# EAGLE schematic LEDSyncDRVG2 (EAGLE 9.6.2)

## Sheet 1 of 5
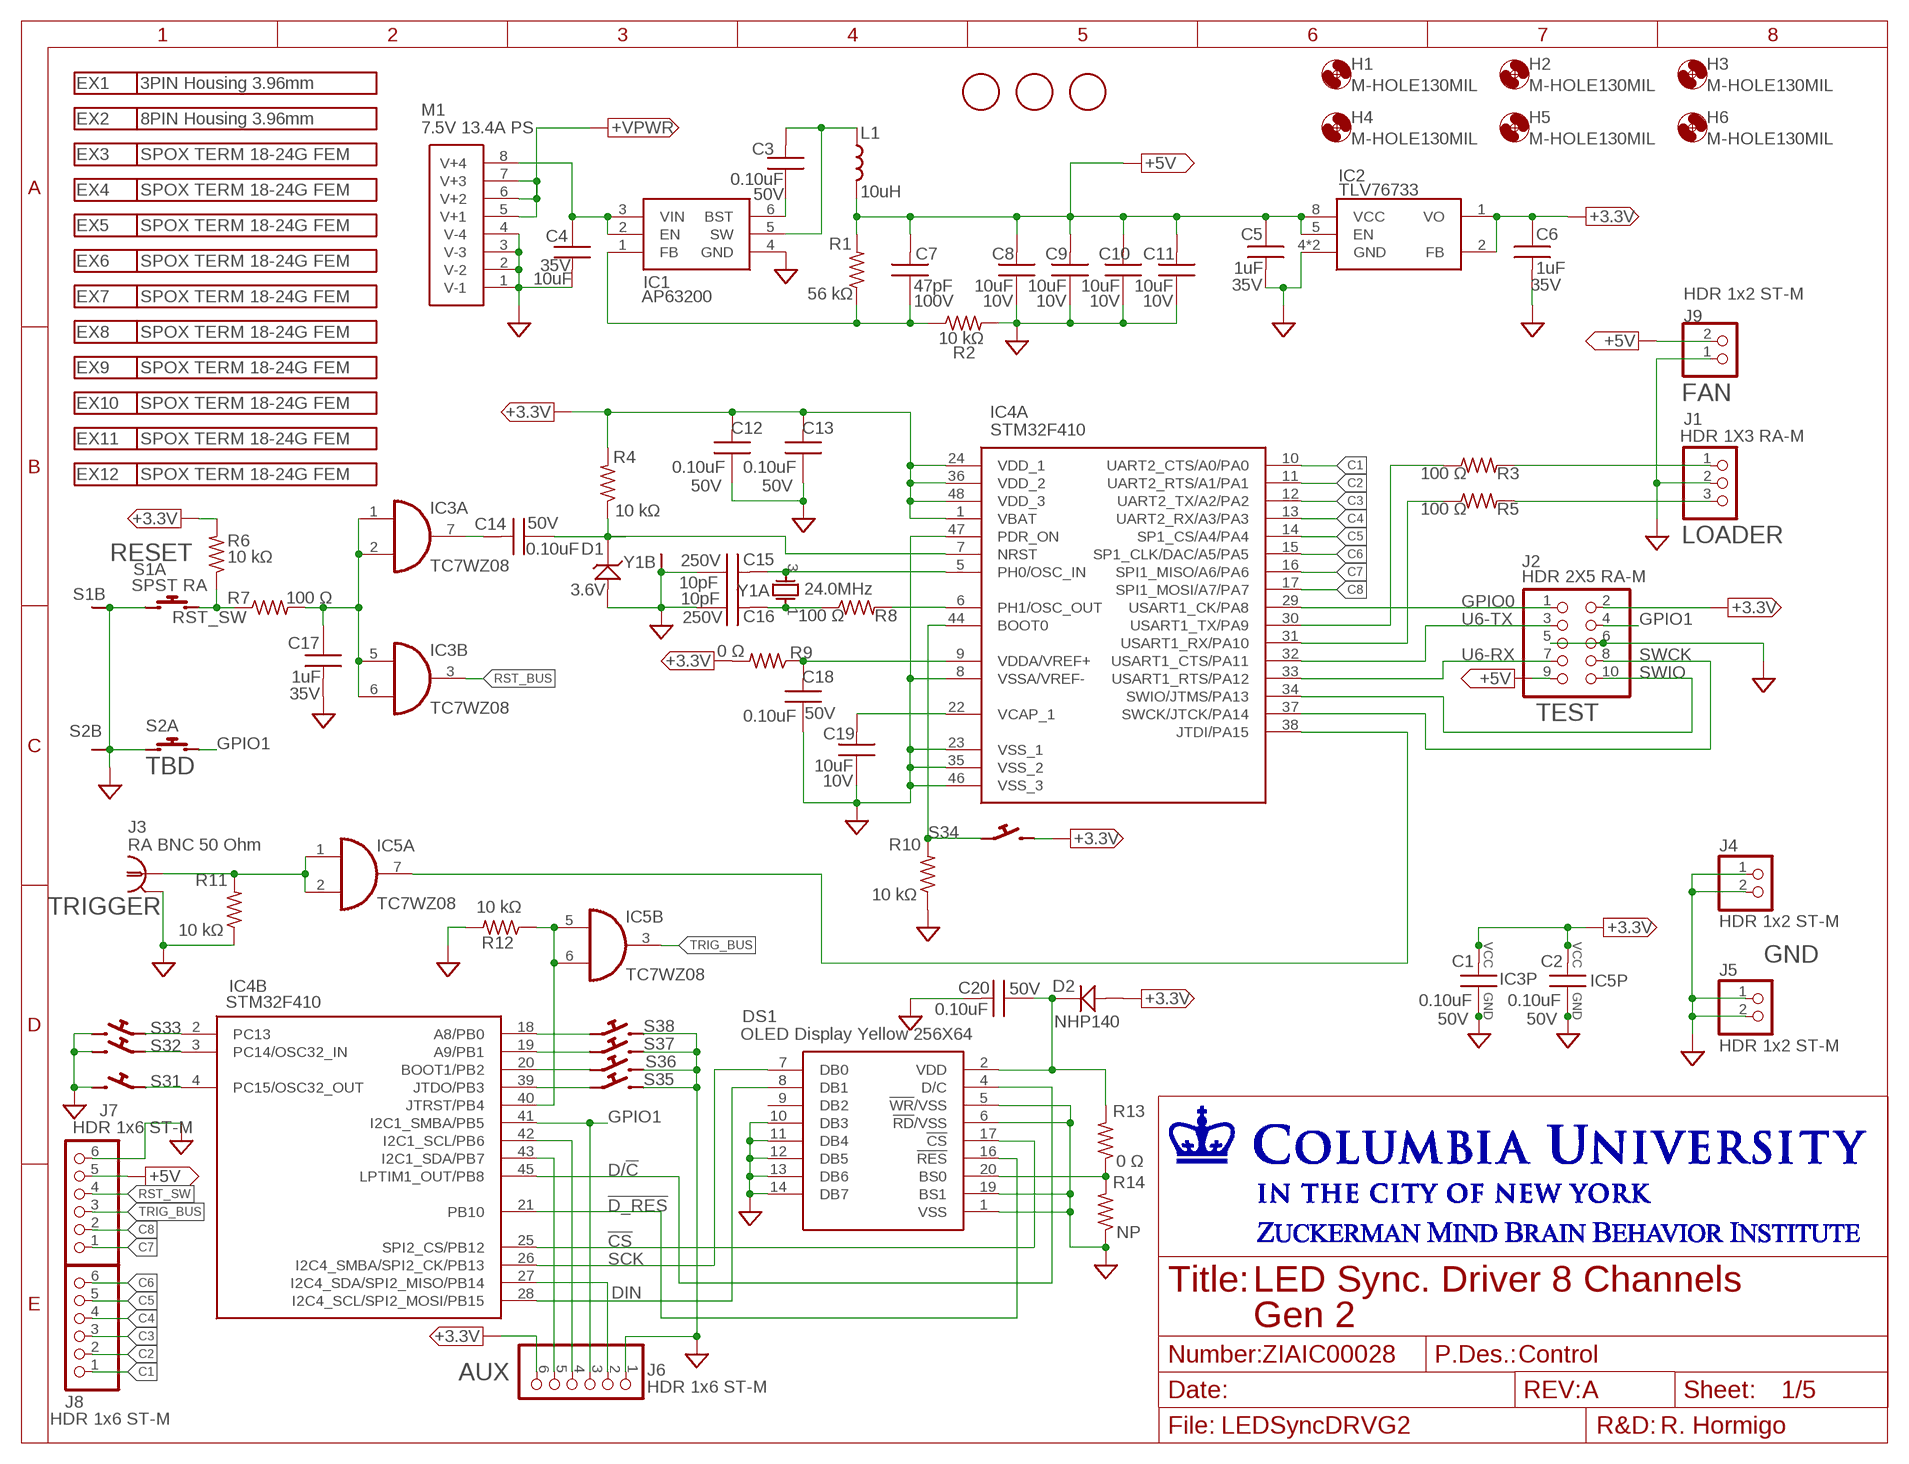
[diagram p0: schematic, sheet 1]
EX1 (EXTCONNWIRE_HOUSING_3P_3.96MM): DESCRIPTION: 3.96mm Pitch SPOX Crimp Housing, Female 3 Pin; DSHEET: https://www.mouser.com/datasheet/2/276/0009501031_CRIMP_HOUSINGS-156478.pdf; MNF: MOLEX; MPN: 09-50-1031; VALUE: 3PIN Housing 3.96mm; VENDOR: Mouser
EX2 (EXTCONNWIRE_HOUSING_8P_3.96MM): DESCRIPTION: 3.96mm Pitch SPOX Crimp Housing, Female 8 Pin; DSHEET: https://www.mouser.com/datasheet/2/276/0009501081_CRIMP_HOUSINGS-156365.pdf; MNF: MOLEX; MPN: 09-50-1081; VALUE: 8PIN Housing 3.96mm; VENDOR: Mouser
EX3 (EXTCONNSPOX_MOLEX5194_CRIMP_TERMINAL_F): CURRENT: 7A@AWG18; DESCRIPTION: SPOX Crimp Female Terminal 5194, 18-24 AWG, Brass, 7A@AWG18; DSHEET: https://www.mouser.com/datasheet/2/276/0008701031_CRIMP_TERMINALS-156261.pdf; MNF: MOLEX; MPN: 08-70-1031; VALUE: SPOX TERM 18-24G FEM; VENDOR: Mouser
EX4 (EXTCONNSPOX_MOLEX5194_CRIMP_TERMINAL_F): CURRENT: 7A@AWG18; DESCRIPTION: SPOX Crimp Female Terminal 5194, 18-24 AWG, Brass, 7A@AWG18; DSHEET: https://www.mouser.com/datasheet/2/276/0008701031_CRIMP_TERMINALS-156261.pdf; MNF: MOLEX; MPN: 08-70-1031; VALUE: SPOX TERM 18-24G FEM; VENDOR: Mouser
EX5 (EXTCONNSPOX_MOLEX5194_CRIMP_TERMINAL_F): CURRENT: 7A@AWG18; DESCRIPTION: SPOX Crimp Female Terminal 5194, 18-24 AWG, Brass, 7A@AWG18; DSHEET: https://www.mouser.com/datasheet/2/276/0008701031_CRIMP_TERMINALS-156261.pdf; MNF: MOLEX; MPN: 08-70-1031; VALUE: SPOX TERM 18-24G FEM; VENDOR: Mouser
EX6 (EXTCONNSPOX_MOLEX5194_CRIMP_TERMINAL_F): CURRENT: 7A@AWG18; DESCRIPTION: SPOX Crimp Female Terminal 5194, 18-24 AWG, Brass, 7A@AWG18; DSHEET: https://www.mouser.com/datasheet/2/276/0008701031_CRIMP_TERMINALS-156261.pdf; MNF: MOLEX; MPN: 08-70-1031; VALUE: SPOX TERM 18-24G FEM; VENDOR: Mouser
EX7 (EXTCONNSPOX_MOLEX5194_CRIMP_TERMINAL_F): CURRENT: 7A@AWG18; DESCRIPTION: SPOX Crimp Female Terminal 5194, 18-24 AWG, Brass, 7A@AWG18; DSHEET: https://www.mouser.com/datasheet/2/276/0008701031_CRIMP_TERMINALS-156261.pdf; MNF: MOLEX; MPN: 08-70-1031; VALUE: SPOX TERM 18-24G FEM; VENDOR: Mouser
EX8 (EXTCONNSPOX_MOLEX5194_CRIMP_TERMINAL_F): CURRENT: 7A@AWG18; DESCRIPTION: SPOX Crimp Female Terminal 5194, 18-24 AWG, Brass, 7A@AWG18; DSHEET: https://www.mouser.com/datasheet/2/276/0008701031_CRIMP_TERMINALS-156261.pdf; MNF: MOLEX; MPN: 08-70-1031; VALUE: SPOX TERM 18-24G FEM; VENDOR: Mouser
EX9 (EXTCONNSPOX_MOLEX5194_CRIMP_TERMINAL_F): CURRENT: 7A@AWG18; DESCRIPTION: SPOX Crimp Female Terminal 5194, 18-24 AWG, Brass, 7A@AWG18; DSHEET: https://www.mouser.com/datasheet/2/276/0008701031_CRIMP_TERMINALS-156261.pdf; MNF: MOLEX; MPN: 08-70-1031; VALUE: SPOX TERM 18-24G FEM; VENDOR: Mouser
EX10 (EXTCONNSPOX_MOLEX5194_CRIMP_TERMINAL_F): CURRENT: 7A@AWG18; DESCRIPTION: SPOX Crimp Female Terminal 5194, 18-24 AWG, Brass, 7A@AWG18; DSHEET: https://www.mouser.com/datasheet/2/276/0008701031_CRIMP_TERMINALS-156261.pdf; MNF: MOLEX; MPN: 08-70-1031; VALUE: SPOX TERM 18-24G FEM; VENDOR: Mouser
EX11 (EXTCONNSPOX_MOLEX5194_CRIMP_TERMINAL_F): CURRENT: 7A@AWG18; DESCRIPTION: SPOX Crimp Female Terminal 5194, 18-24 AWG, Brass, 7A@AWG18; DSHEET: https://www.mouser.com/datasheet/2/276/0008701031_CRIMP_TERMINALS-156261.pdf; MNF: MOLEX; MPN: 08-70-1031; VALUE: SPOX TERM 18-24G FEM; VENDOR: Mouser
EX12 (EXTCONNSPOX_MOLEX5194_CRIMP_TERMINAL_F): CURRENT: 7A@AWG18; DESCRIPTION: SPOX Crimp Female Terminal 5194, 18-24 AWG, Brass, 7A@AWG18; DSHEET: https://www.mouser.com/datasheet/2/276/0008701031_CRIMP_TERMINALS-156261.pdf; MNF: MOLEX; MPN: 08-70-1031; VALUE: SPOX TERM 18-24G FEM; VENDOR: Mouser
FRAME1 (LETTER_L): ENG_NAME: R. Hormigo; NUMBER: ZIAIC00028; PDESC: Control; REV: A; TITLE_L1: LED Sync. Driver 8 Channels; TITLE_L2: Gen 2

### Parts
C1  0.10uF  MLCC_0603_100N  [MLCC_0603]
C2  0.10uF  MLCC_0603_100N  [MLCC_0603]
C3  0.10uF  MLCC_0603_100N  [MLCC_0603]
C4  10uF  MLCC1206_  [MLCC_1206]
C5  1uF  MLCC_0603_1UF  [MLCC_0603]
C6  1uF  MLCC_0603_1UF  [MLCC_0603]
C7  47pF  MLCC_0603_47P  [MLCC_0603]
C8  10uF  MLCC_0603_10UF-10V  [MLCC_0603]
C9  10uF  MLCC_0603_10UF-10V  [MLCC_0603]
C10  10uF  MLCC_0603_10UF-10V  [MLCC_0603]
C11  10uF  MLCC_0603_10UF-10V  [MLCC_0603]
C12  0.10uF  MLCC_0603_100N  [MLCC_0603]
C13  0.10uF  MLCC_0603_100N  [MLCC_0603]
C14  0.10uF  MLCC_0603_100N  [MLCC_0603]
C15  10pF  MLCC_0603_10P  [MLCC_0603]
C16  10pF  MLCC_0603_10P  [MLCC_0603]
C17  1uF  MLCC_0603_1UF  [MLCC_0603]
C18  0.10uF  MLCC_0603_100N  [MLCC_0603]
C19  10uF  MLCC_0603_10UF-10V  [MLCC_0603]
C20  0.10uF  MLCC_0603_100N  [MLCC_0603]
D1  3.6V  DIODE_ZENERZND3.6V  [SOD3716X135N_DIODE]
D2  NHP140  DIODE_RECNHP140  [SOD-123FL]
DS1  OLED Display Yellow 256X64  DISPLAY20P  [DISPLAY20P]
H1  M-HOLE130MIL  [4-40_130HOLE_260CLEAR]
H2  M-HOLE130MIL  [4-40_130HOLE_260CLEAR]
H3  M-HOLE130MIL  [4-40_130HOLE_260CLEAR]
H4  M-HOLE130MIL  [4-40_130HOLE_260CLEAR]
H5  M-HOLE130MIL  [4-40_130HOLE_260CLEAR]
H6  M-HOLE130MIL  [4-40_130HOLE_260CLEAR]
IC1  AP63200  [SOT95P280X100-6N]
IC2  TLV76733  LDO8P_TLV76733DGNR  [VSSOP8-DGK-065P]
IC3  TC7WZ08  AND2_TSOP8  [SOP50P310X90-8N]
IC4  STM32F410  STM32F410C  [QFP50P900X900X160-48N]
IC5  TC7WZ08  AND2_TSOP8  [SOP50P310X90-8N]
J1  HDR 1X3 RA-M  PIN-1X3HDR_1X3RAS_M  [HDR_1X3RAS]
J2  HDR 2X5 RA-M  PIN-2X5HDR_2X5RAS_M  [HDR_2X5M_RAS]
J3  RA BNC 50 Ohm  BNC-4P  [BNC_AMP_227161]
J4  HDR 1x2 ST-M  PIN-1X22STMSHDR  [HDR_1X2]
J5  HDR 1x2 ST-M  PIN-1X22STMSHDR  [HDR_1X2]
J6  HDR 1x6 ST-M  PIN-1X6_6STM  [HDR_1X06]
J7  HDR 1x6 ST-M  PIN-1X6_6STM  [HDR_1X06]
J8  HDR 1x6 ST-M  PIN-1X6_6STM  [HDR_1X06]
J9  HDR 1x2 ST-M  PIN-1X22STMSHDR  [HDR_1X2]
L1  10uH  INDUCTOR  [IND_5X5MM-5045]
M1  7.5V 13.4A PS  PS_MOLEX8P  [PS_5X3_MOLEX8P]
R1  56 kΩ  RES_0603_56K0  [R0603]
R2  10 kΩ  RES_0603_10K0  [R0603]
R3  100 Ω  RES_0603_100R  [R0603]
R4  10 kΩ  RES_0603_10K0  [R0603]
R5  100 Ω  RES_0603_100R  [R0603]
R6  10 kΩ  RES_0603_10K0  [R0603]
R7  100 Ω  RES_0603_100R  [R0603]
R8  100 Ω  RES_0603_100R  [R0603]
R9  0 Ω  RES_0603_0000  [R0603]
R10  10 kΩ  RES_0603_10K0  [R0603]
R11  10 kΩ  RES_0603_10K0  [R0603]
R12  10 kΩ  RES_0603_10K0  [R0603]
R13  0 Ω  RES_0603_0000  [R0603]
R14  NP  RES_0603_NP  [R0603]
S1  SPST RA  MOM_SWITCH_SPST_SH  [SITCH_PB_RA_800SP9B6M6RE]
S2  SPST RA  MOM_SWITCH_SPST_SH  [SITCH_PB_RA_800SP9B6M6RE]
S3  DIP8-RA  SWITCH_X8_DIPSWDTS65  [SWITCHX8_DIP_RA_0.1IN]
U$1  FIDUCIAL  [FIDUCIAL_1MM]
U$2  FIDUCIAL  [FIDUCIAL_1MM]
U$3  FIDUCIAL  [FIDUCIAL_1MM]
Y1  24.0MHz  XTAL4P  [XTAL4P_3.2X2.5MM]

### Nets
!CS: DS1.17(!CS) IC4.25(B:SPI2_CS/PB12)
!D_RES: DS1.16(!RES) IC4.21(B:PB10)
+3.3V: C1.2 C2.2 C6.1 C12.2 C13.2 D2.2(A) IC2.1(VO) IC2.2(FB) IC3.8(P:VCC) IC4.1(A:VBAT) IC4.24(A:VDD_1) IC4.36(A:VDD_2) IC4.48(A:VDD_3) IC5.8(P:VCC) J2.2 J6.6 R4.2 R6.2 R9.2 S3.8 ; also sheet 2,3,4,5
+5V: C5.1 C7.2 C8.2 C9.2 C10.2 C11.2 IC2.5(EN) IC2.8(VCC) J2.9 J7.5 J9.2 L1.2 R1.2 ; also sheet 2,3,4,5
+VPWR: M1.5(V+1) M1.6(V+2) M1.7(V+3) ; also sheet 2,3,4,5
C1: IC4.10(A:UART2_CTS/A0/PA0) J8.1 ; also sheet 2
C2: IC4.11(A:UART2_RTS/A1/PA1) J8.2 ; also sheet 2
C3: IC4.12(A:UART2_TX/A2/PA2) J8.3 ; also sheet 3
C4: IC4.13(A:UART2_RX/A3/PA3) J8.4 ; also sheet 3
C5: IC4.14(A:SP1_CS/A4/PA4) J8.5 ; also sheet 4
C6: IC4.15(A:SP1_CLK/DAC/A5/PA5) J8.6 ; also sheet 4
C7: IC4.16(A:SPI1_MISO/A6/PA6) J7.1 ; also sheet 5
C8: IC4.17(A:SPI1_MOSI/A7/PA7) J7.2 ; also sheet 5
D/!C: DS1.4(D/C) IC4.45(B:LPTIM1_OUT/PB8)
DIN: DS1.8(DB1) IC4.28(B:I2C4_SCL/SPI2_MOSI/PB15)
GND: C1.1 C2.1 C4.2 C5.2 C6.2 C8.1 C9.1 C10.1 C11.1 C12.1 C13.1 C15.1 C16.1 C17.2 C18.1 C19.1 C20.2 D1.2(A) DS1.1(VSS) DS1.5(!WR!/VSS) DS1.6(!RD!/VSS) DS1.10(DB3) DS1.11(DB4) DS1.12(DB5) DS1.13(DB6) DS1.14(DB7) DS1.19(BS1) IC1.4(GND) IC2.4(GND) IC2.6(GND) IC3.4(P:GND) IC4.8(A:VSSA/VREF-) IC4.23(A:VSS_1) IC4.35(A:VSS_2) IC4.46(A:VSS_3) IC4.47(A:PDR_ON) IC5.4(P:GND) J1.2 J2.5 J2.6 J3.2 J4.1 J4.2 J5.1 J5.2 J6.1 J7.6 J9.1 M1.1(V-1) M1.2(V-2) M1.3(V-3) M1.4(V-4) R2.2 R10.1 R11.1 R12.2 R14.1 S1.1 S1.MH1(B:G1) S1.MH2(B:G1) S2.1 S2.MH1(B:G1) S2.MH2(B:G1) S3.2 S3.4 S3.6 S3.10 S3.12 S3.14 S3.16 Y1.2(B:G1) Y1.4(B:G1) ; also sheet 2,3,4,5
GPIO0: IC4.29(A:USART1_CK/PA8) J2.1
GPIO1: IC4.41(B:I2C1_SMBA/PB5) J2.4 J6.3 S2.3
N$1: C4.1 IC1.2(EN) IC1.3(VIN) M1.8(V+4)
N$2: IC4.6(A:PH1/OSC_OUT) R8.2
N$3: C16.2 R8.1 Y1.1(A:IO)
N$4: C15.2 IC4.5(A:PH0/OSC_IN) Y1.3(A:OI)
N$5: C18.2 IC4.9(A:VDDA/VREF+) R9.1
N$6: IC4.3(B:PC14/OSC32_IN) S3.3
N$7: C19.2 IC4.22(A:VCAP_1)
N$8: IC4.44(A:BOOT0) R10.2 S3.7
N$9: C14.1 D1.1(K) IC4.7(A:NRST) R4.1
N$10: C3.2 IC1.5(SW) L1.1
N$11: C7.1 IC1.1(FB) R1.1 R2.1
N$12: C3.1 IC1.6(BST)
N$13: IC4.18(B:A8/PB0) S3.15
N$14: IC4.19(B:A9/PB1) S3.13
N$15: J1.3 R5.2
N$16: J1.1 R3.2
N$17: IC4.20(B:BOOT1/PB2) S3.11
N$18: IC4.39(B:JTDO/PB3) S3.9
N$19: IC4.2(B:PC13) S3.5
N$20: DS1.20(BS0) R13.1 R14.2
N$21: IC4.4(B:PC15/OSC32_OUT) S3.1
N$22: IC4.38(A:JTDI/PA15) IC5.7(A:O)
N$23: C20.1 D2.1(K) DS1.2(VDD) R13.2
N$24: IC4.27(B:I2C4_SDA/SPI2_MISO/PB14) J6.2
N$25: IC4.30(A:USART1_TX/PA9) R3.1
N$26: IC4.43(B:I2C1_SDA/PB7) J6.5
N$27: IC4.42(B:I2C1_SCL/PB6) J6.4
N$28: C14.2 IC3.7(A:O)
N$29: IC4.31(A:USART1_RX/PA10) R5.1
N$30: IC4.40(B:JTRST/PB4) IC5.5(B:I0) IC5.6(B:I1) R12.1
N$31: IC5.1(A:I0) IC5.2(A:I1) J3.1 R11.2
RST: C17.1 IC3.1(A:I0) IC3.2(A:I1) IC3.5(B:I0) IC3.6(B:I1) R7.2
RST_BUS: IC3.3(B:O) ; also sheet 2,3,4,5
RST_SW: J7.4 R6.1 R7.1 S1.3
SCK: DS1.7(DB0) IC4.26(B:I2C4_SMBA/SPI2_CK/PB13)
SWCK: IC4.37(A:SWCK/JTCK/PA14) J2.8
SWIO: IC4.34(A:SWIO/JTMS/PA13) J2.10
TRIG_BUS: IC5.3(B:O) J7.3 ; also sheet 2,3,4,5
U6-RX: IC4.33(A:USART1_RTS/PA12) J2.7
U6-TX: IC4.32(A:USART1_CTS/PA11) J2.3
Unconnected: DS1.9(DB2)

### Notes on the sheet
- FAN
- LOADER
- RESET
- TEST
- TBD
- TRIGGER
- GND
- AUX

## Sheet 2 of 5
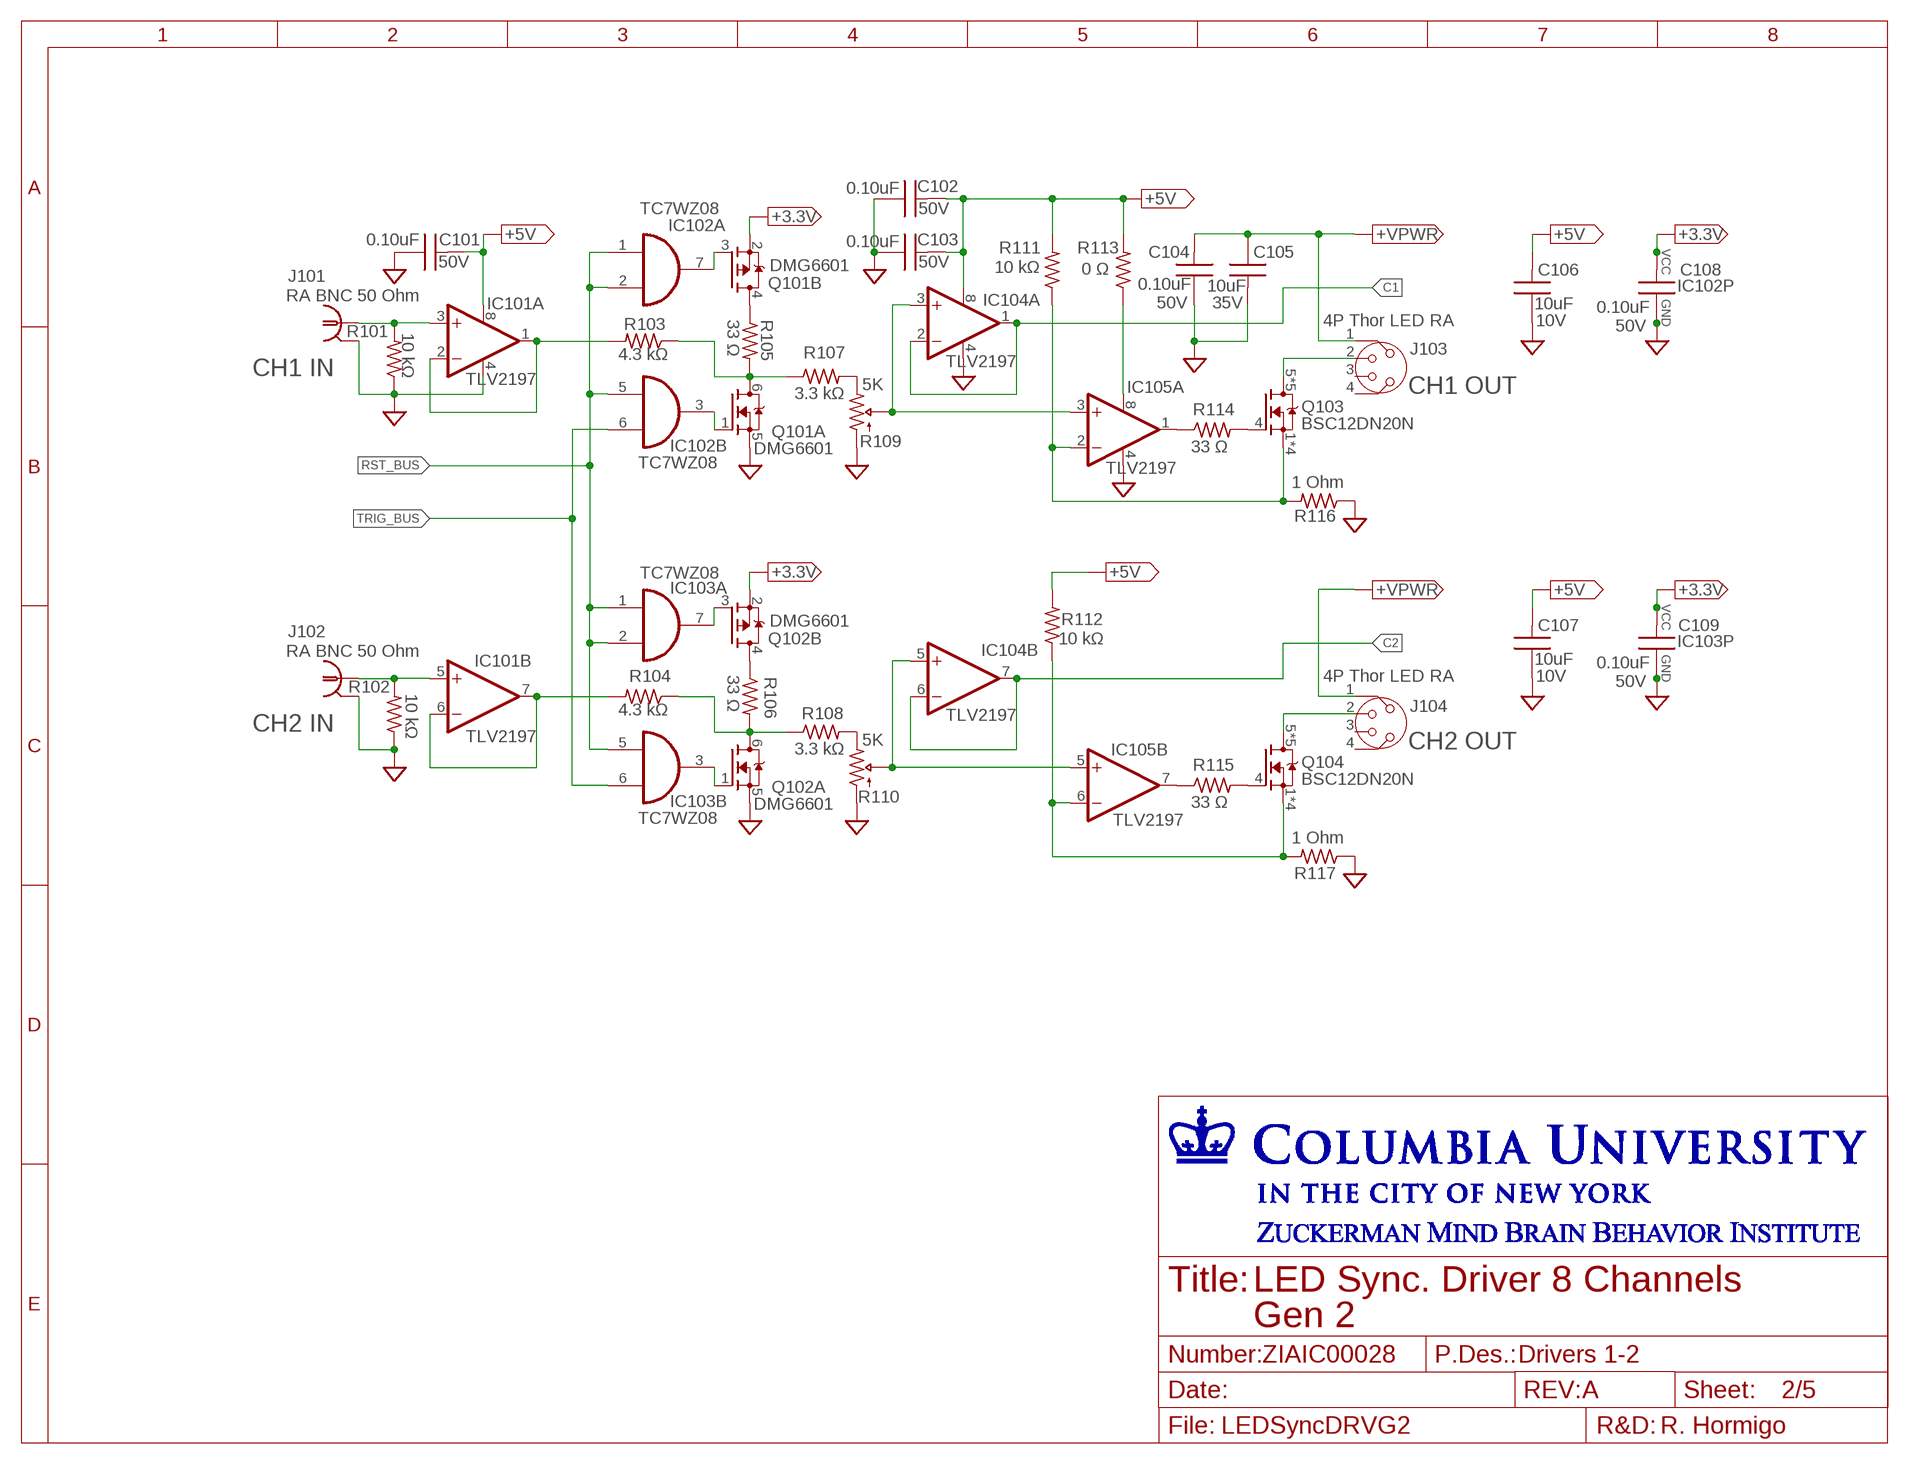
[diagram p1: schematic, sheet 2]
FRAME101 (LETTER_L): ENG_NAME: R. Hormigo; NUMBER: ZIAIC00028; PDESC: Drivers 1-2; REV: A; TITLE_L1: LED Sync. Driver 8 Channels; TITLE_L2: Gen 2

### Parts
C101  0.10uF  MLCC_0603_100N  [MLCC_0603]
C102  0.10uF  MLCC_0603_100N  [MLCC_0603]
C103  0.10uF  MLCC_0603_100N  [MLCC_0603]
C104  0.10uF  MLCC_0603_100N  [MLCC_0603]
C105  10uF  MLCC1206_  [MLCC_1206]
C106  10uF  MLCC_0603_10UF-10V  [MLCC_0603]
C107  10uF  MLCC_0603_10UF-10V  [MLCC_0603]
C108  0.10uF  MLCC_0603_100N  [MLCC_0603]
C109  0.10uF  MLCC_0603_100N  [MLCC_0603]
IC101  TLV2197  OPA_D_TLV2197QDGKTLV2172IDGKR  [VSSOP8-DGK-065P]
IC102  TC7WZ08  AND2_TSOP8  [SOP50P310X90-8N]
IC103  TC7WZ08  AND2_TSOP8  [SOP50P310X90-8N]
IC104  TLV2197  OPA_D_TLV2197QDGKTLV2172IDGKR  [VSSOP8-DGK-065P]
IC105  TLV2197  OPA_D_TLV2197QDGKTLV2172IDGKR  [VSSOP8-DGK-065P]
J101  RA BNC 50 Ohm  BNC-4P  [BNC_AMP_227161]
J102  RA BNC 50 Ohm  BNC-4P  [BNC_AMP_227161]
J103  4P Thor LED RA  CIRCULAR-4P-THOR-F  [CIR_PHX4P_RA]
J104  4P Thor LED RA  CIRCULAR-4P-THOR-F  [CIR_PHX4P_RA]
Q101  DMG6601  MOSFET-PN  [SOT95P280X100-6N]
Q102  DMG6601  MOSFET-PN  [SOT95P280X100-6N]
Q103  BSC12DN20N  MOSFET-NBSC12DN20NS3GN-MOSFET  [TDSON-8]
Q104  BSC12DN20N  MOSFET-NBSC12DN20NS3GN-MOSFET  [TDSON-8]
R101  10 kΩ  RES_0603_10K0  [R0603]
R102  10 kΩ  RES_0603_10K0  [R0603]
R103  4.3 kΩ  RES_0603_4K30  [R0603]
R104  4.3 kΩ  RES_0603_4K30  [R0603]
R105  33 Ω  RES_0603_33R0  [R0603]
R106  33 Ω  RES_0603_33R0  [R0603]
R107  3.3 kΩ  RES_0603_3K30  [R0603]
R108  3.3 kΩ  RES_0603_3K30  [R0603]
R109  5K  RES_TRIM_5K_RA_MTURN  [MTBOURNS_RA_LONG]
R110  5K  RES_TRIM_5K_RA_MTURN  [MTBOURNS_RA_LONG]
R111  10 kΩ  RES_0603_10K0  [R0603]
R112  10 kΩ  RES_0603_10K0  [R0603]
R113  0 Ω  RES_0603_0000  [R0603]
R114  33 Ω  RES_0603_33R0  [R0603]
R115  33 Ω  RES_0603_33R0  [R0603]
R116  1 Ohm  RES_1225_  [R1225]
R117  1 Ohm  RES_1225_  [R1225]

### Nets
+3.3V: C108.2 C109.2 IC102.8(P:VCC) IC103.8(P:VCC) Q101.2(B:S) Q102.2(B:S) ; also sheet 1,3,4,5
+5V: C101.2 C102.2 C103.2 C106.2 C107.2 IC101.8(A:V+) IC104.8(A:V+) R111.2 R112.2 R113.2 ; also sheet 1,3,4,5
+VPWR: C104.2 C105.1 J103.1 J104.1 ; also sheet 1,3,4,5
C1: IC104.1(A:OUT) IC104.2(A:-IN) ; also sheet 1
C2: IC104.6(B:-IN) IC104.7(B:OUT) ; also sheet 1
GND: C101.1 C102.1 C103.1 C104.1 C105.2 C106.1 C107.1 C108.1 C109.1 IC101.4(A:V-) IC102.4(P:GND) IC103.4(P:GND) IC104.4(A:V-) IC105.4(A:V-) J101.2 J102.2 Q101.5(A:S) Q102.5(A:S) R101.1 R102.1 R109.1(START) R110.1(START) R116.1 R117.1 ; also sheet 1,3,4,5
N$33: Q102.4(B:D) R106.1
N$34: Q101.4(B:D) R105.1
N$35: Q101.6(A:D) R103.1 R105.2 R107.1
N$36: IC102.3(B:O) Q101.1(A:G)
N$37: IC102.7(A:O) Q101.3(B:G)
N$38: IC101.1(A:OUT) IC101.2(A:-IN) R103.2
N$39: IC101.3(A:+IN) J101.1 R101.2
N$40: R107.2 R109.3(END)
N$41: Q102.6(A:D) R104.1 R106.2 R108.1
N$42: IC104.3(A:+IN) IC105.3(A:+IN) R109.2(WIPER)
N$43: IC105.1(A:OUT) R114.1
N$44: IC105.2(A:-IN) Q103.1(S) Q103.2(S) Q103.3(S) Q103.10(S) R111.1 R116.2
N$45: Q103.4(G) R114.2
N$46: IC103.3(B:O) Q102.1(A:G)
N$47: J103.2 Q103.5(D) Q103.6(D) Q103.7(D) Q103.8(D) Q103.9(D)
N$48: IC103.7(A:O) Q102.3(B:G)
N$49: IC101.5(B:+IN) J102.1 R102.2
N$50: IC101.6(B:-IN) IC101.7(B:OUT) R104.2
N$51: R108.2 R110.3(END)
N$52: IC104.5(B:+IN) IC105.5(B:+IN) R110.2(WIPER)
N$53: IC105.6(B:-IN) Q104.1(S) Q104.2(S) Q104.3(S) Q104.10(S) R112.1 R117.2
N$54: IC105.7(B:OUT) R115.1
N$55: Q104.4(G) R115.2
N$56: J104.2 Q104.5(D) Q104.6(D) Q104.7(D) Q104.8(D) Q104.9(D)
N$58: IC105.8(A:V+) R113.1
RST_BUS: IC102.1(A:I0) IC102.2(A:I1) IC102.5(B:I0) IC103.1(A:I0) IC103.2(A:I1) IC103.5(B:I0) ; also sheet 1,3,4,5
TRIG_BUS: IC102.6(B:I1) IC103.6(B:I1) ; also sheet 1,3,4,5
Unconnected: J103.3 J103.4 J104.3 J104.4

### Notes on the sheet
- CH1 IN
- CH1 OUT
- CH2 IN
- CH2 OUT

## Sheet 3 of 5
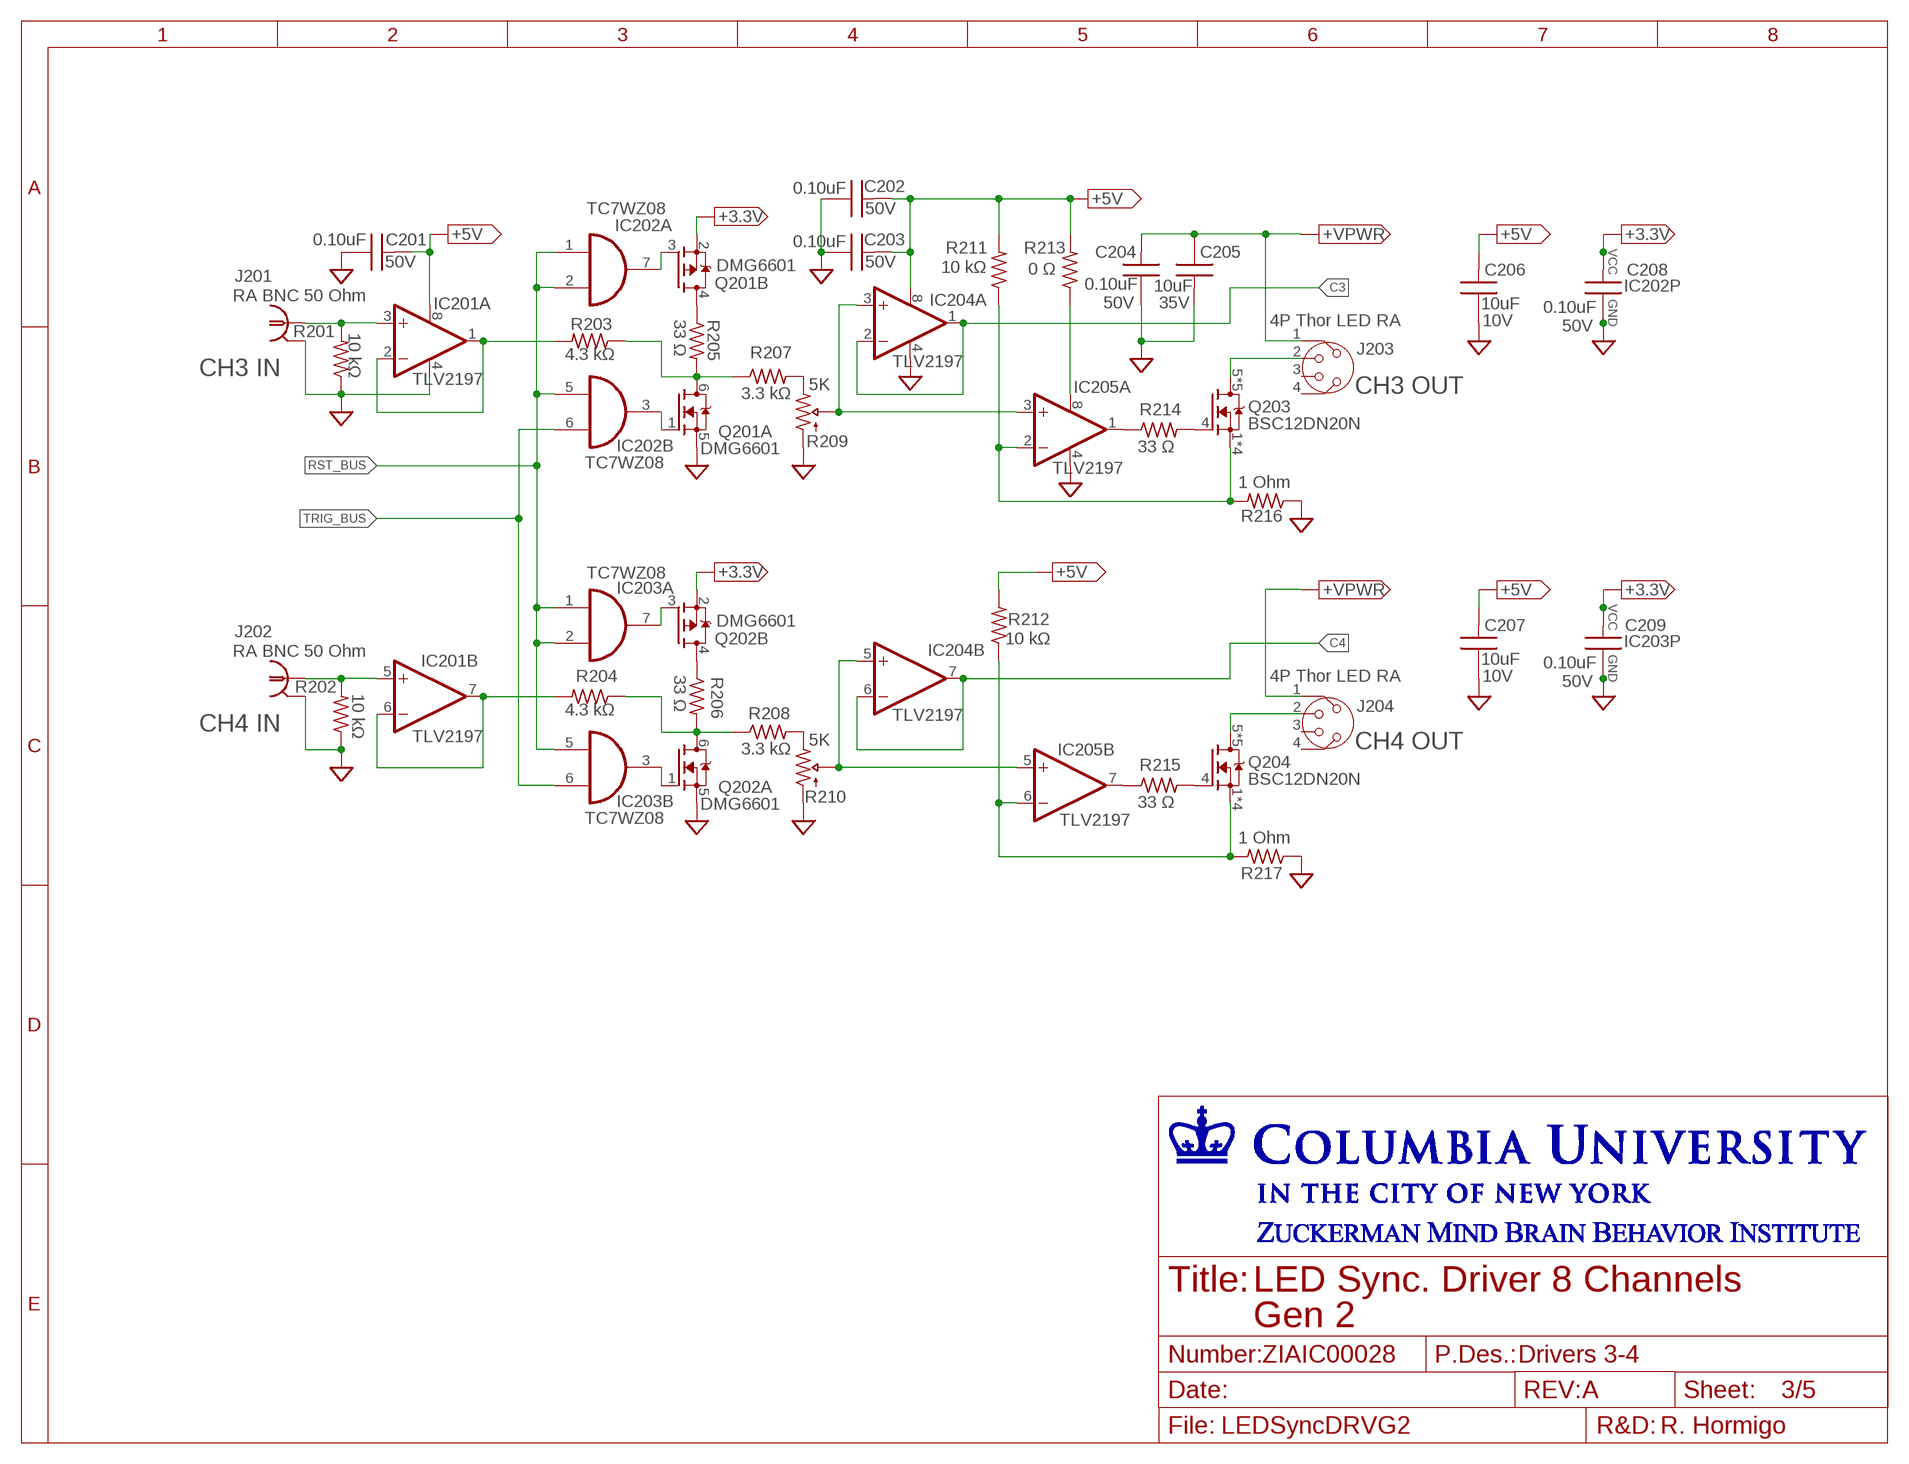
[diagram p2: schematic, sheet 3]
FRAME201 (LETTER_L): ENG_NAME: R. Hormigo; NUMBER: ZIAIC00028; PDESC: Drivers 3-4; REV: A; TITLE_L1: LED Sync. Driver 8 Channels; TITLE_L2: Gen 2

### Parts
C201  0.10uF  MLCC_0603_100N  [MLCC_0603]
C202  0.10uF  MLCC_0603_100N  [MLCC_0603]
C203  0.10uF  MLCC_0603_100N  [MLCC_0603]
C204  0.10uF  MLCC_0603_100N  [MLCC_0603]
C205  10uF  MLCC1206_  [MLCC_1206]
C206  10uF  MLCC_0603_10UF-10V  [MLCC_0603]
C207  10uF  MLCC_0603_10UF-10V  [MLCC_0603]
C208  0.10uF  MLCC_0603_100N  [MLCC_0603]
C209  0.10uF  MLCC_0603_100N  [MLCC_0603]
IC201  TLV2197  OPA_D_TLV2197QDGKTLV2172IDGKR  [VSSOP8-DGK-065P]
IC202  TC7WZ08  AND2_TSOP8  [SOP50P310X90-8N]
IC203  TC7WZ08  AND2_TSOP8  [SOP50P310X90-8N]
IC204  TLV2197  OPA_D_TLV2197QDGKTLV2172IDGKR  [VSSOP8-DGK-065P]
IC205  TLV2197  OPA_D_TLV2197QDGKTLV2172IDGKR  [VSSOP8-DGK-065P]
J201  RA BNC 50 Ohm  BNC-4P  [BNC_AMP_227161]
J202  RA BNC 50 Ohm  BNC-4P  [BNC_AMP_227161]
J203  4P Thor LED RA  CIRCULAR-4P-THOR-F  [CIR_PHX4P_RA]
J204  4P Thor LED RA  CIRCULAR-4P-THOR-F  [CIR_PHX4P_RA]
Q201  DMG6601  MOSFET-PN  [SOT95P280X100-6N]
Q202  DMG6601  MOSFET-PN  [SOT95P280X100-6N]
Q203  BSC12DN20N  MOSFET-NBSC12DN20NS3GN-MOSFET  [TDSON-8]
Q204  BSC12DN20N  MOSFET-NBSC12DN20NS3GN-MOSFET  [TDSON-8]
R201  10 kΩ  RES_0603_10K0  [R0603]
R202  10 kΩ  RES_0603_10K0  [R0603]
R203  4.3 kΩ  RES_0603_4K30  [R0603]
R204  4.3 kΩ  RES_0603_4K30  [R0603]
R205  33 Ω  RES_0603_33R0  [R0603]
R206  33 Ω  RES_0603_33R0  [R0603]
R207  3.3 kΩ  RES_0603_3K30  [R0603]
R208  3.3 kΩ  RES_0603_3K30  [R0603]
R209  5K  RES_TRIM_5K_RA_MTURN  [MTBOURNS_RA_LONG]
R210  5K  RES_TRIM_5K_RA_MTURN  [MTBOURNS_RA_LONG]
R211  10 kΩ  RES_0603_10K0  [R0603]
R212  10 kΩ  RES_0603_10K0  [R0603]
R213  0 Ω  RES_0603_0000  [R0603]
R214  33 Ω  RES_0603_33R0  [R0603]
R215  33 Ω  RES_0603_33R0  [R0603]
R216  1 Ohm  RES_1225_  [R1225]
R217  1 Ohm  RES_1225_  [R1225]

### Nets
+3.3V: C208.2 C209.2 IC202.8(P:VCC) IC203.8(P:VCC) Q201.2(B:S) Q202.2(B:S) ; also sheet 1,2,4,5
+5V: C201.2 C202.2 C203.2 C206.2 C207.2 IC201.8(A:V+) IC204.8(A:V+) R211.2 R212.2 R213.2 ; also sheet 1,2,4,5
+VPWR: C204.2 C205.1 J203.1 J204.1 ; also sheet 1,2,4,5
C3: IC204.1(A:OUT) IC204.2(A:-IN) ; also sheet 1
C4: IC204.6(B:-IN) IC204.7(B:OUT) ; also sheet 1
GND: C201.1 C202.1 C203.1 C204.1 C205.2 C206.1 C207.1 C208.1 C209.1 IC201.4(A:V-) IC202.4(P:GND) IC203.4(P:GND) IC204.4(A:V-) IC205.4(A:V-) J201.2 J202.2 Q201.5(A:S) Q202.5(A:S) R201.1 R202.1 R209.1(START) R210.1(START) R216.1 R217.1 ; also sheet 1,2,4,5
N$105: Q201.4(B:D) R205.1
N$106: Q201.6(A:D) R203.1 R205.2 R207.1
N$107: IC202.3(B:O) Q201.1(A:G)
N$108: IC202.7(A:O) Q201.3(B:G)
N$109: IC201.3(A:+IN) J201.1 R201.2
N$110: IC201.1(A:OUT) IC201.2(A:-IN) R203.2
N$111: R207.2 R209.3(END)
N$112: IC204.3(A:+IN) IC205.3(A:+IN) R209.2(WIPER)
N$113: IC205.2(A:-IN) Q203.1(S) Q203.2(S) Q203.3(S) Q203.10(S) R211.1 R216.2
N$114: IC205.1(A:OUT) R214.1
N$115: Q203.4(G) R214.2
N$116: J203.2 Q203.5(D) Q203.6(D) Q203.7(D) Q203.8(D) Q203.9(D)
N$117: Q202.4(B:D) R206.1
N$118: Q202.6(A:D) R204.1 R206.2 R208.1
N$119: IC203.3(B:O) Q202.1(A:G)
N$120: IC203.7(A:O) Q202.3(B:G)
N$121: IC201.5(B:+IN) J202.1 R202.2
N$122: IC201.6(B:-IN) IC201.7(B:OUT) R204.2
N$123: R208.2 R210.3(END)
N$124: IC204.5(B:+IN) IC205.5(B:+IN) R210.2(WIPER)
N$125: IC205.6(B:-IN) Q204.1(S) Q204.2(S) Q204.3(S) Q204.10(S) R212.1 R217.2
N$126: Q204.4(G) R215.2
N$127: J204.2 Q204.5(D) Q204.6(D) Q204.7(D) Q204.8(D) Q204.9(D)
N$128: IC205.7(B:OUT) R215.1
N$129: IC205.8(A:V+) R213.1
RST_BUS: IC202.1(A:I0) IC202.2(A:I1) IC202.5(B:I0) IC203.1(A:I0) IC203.2(A:I1) IC203.5(B:I0) ; also sheet 1,2,4,5
TRIG_BUS: IC202.6(B:I1) IC203.6(B:I1) ; also sheet 1,2,4,5
Unconnected: J203.3 J203.4 J204.3 J204.4

### Notes on the sheet
- CH3 IN
- CH3 OUT
- CH4 IN
- CH4 OUT

## Sheet 4 of 5
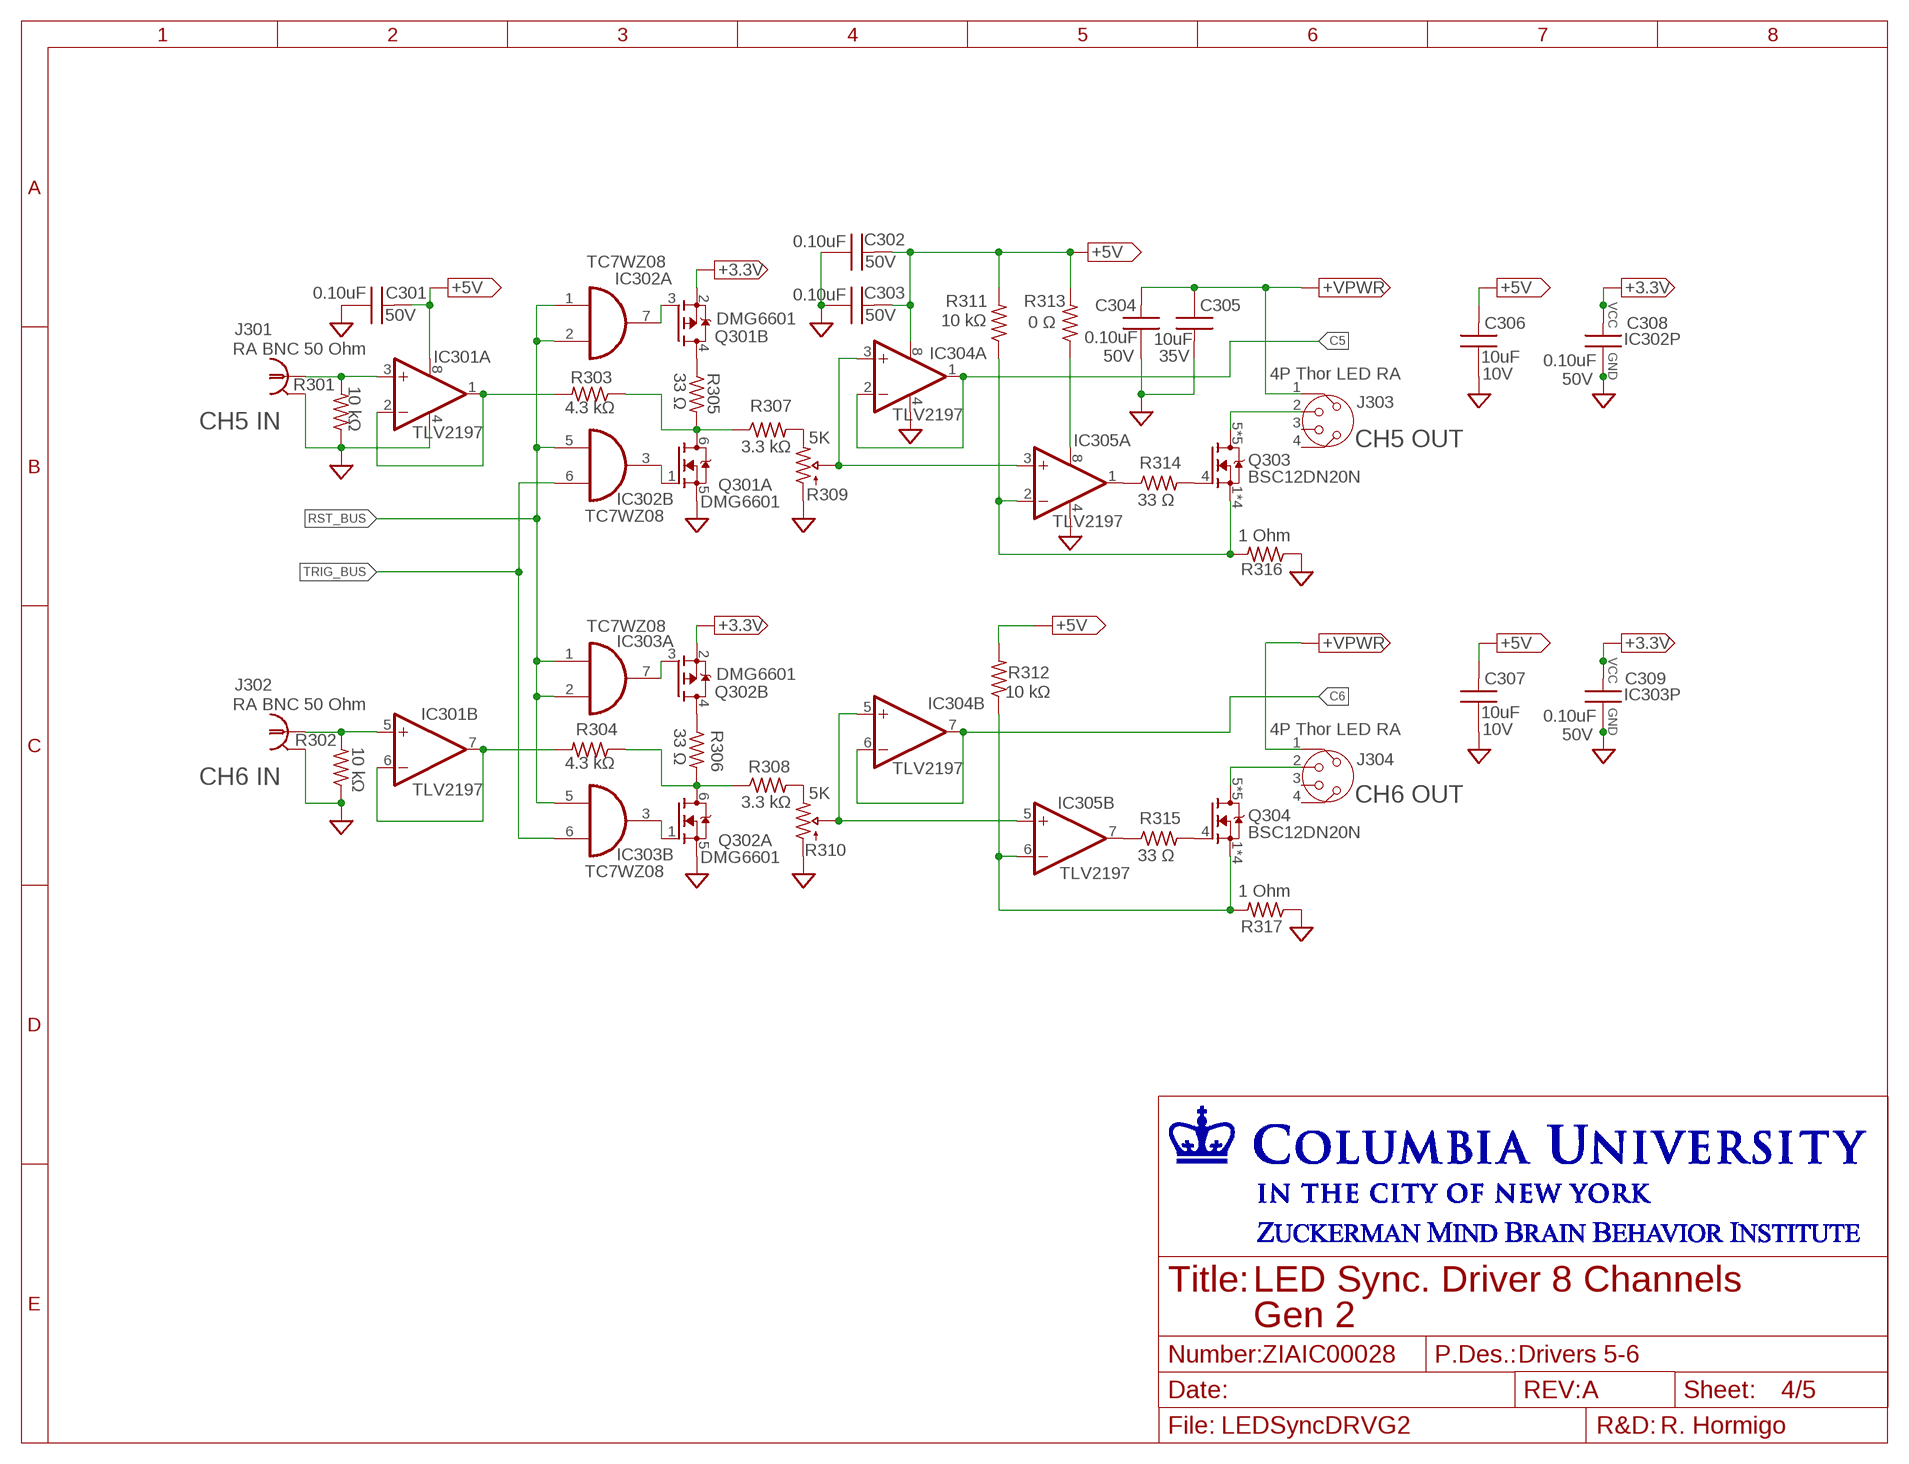
[diagram p3: schematic, sheet 4]
FRAME301 (LETTER_L): ENG_NAME: R. Hormigo; NUMBER: ZIAIC00028; PDESC: Drivers 5-6; REV: A; TITLE_L1: LED Sync. Driver 8 Channels; TITLE_L2: Gen 2

### Parts
C301  0.10uF  MLCC_0603_100N  [MLCC_0603]
C302  0.10uF  MLCC_0603_100N  [MLCC_0603]
C303  0.10uF  MLCC_0603_100N  [MLCC_0603]
C304  0.10uF  MLCC_0603_100N  [MLCC_0603]
C305  10uF  MLCC1206_  [MLCC_1206]
C306  10uF  MLCC_0603_10UF-10V  [MLCC_0603]
C307  10uF  MLCC_0603_10UF-10V  [MLCC_0603]
C308  0.10uF  MLCC_0603_100N  [MLCC_0603]
C309  0.10uF  MLCC_0603_100N  [MLCC_0603]
IC301  TLV2197  OPA_D_TLV2197QDGKTLV2172IDGKR  [VSSOP8-DGK-065P]
IC302  TC7WZ08  AND2_TSOP8  [SOP50P310X90-8N]
IC303  TC7WZ08  AND2_TSOP8  [SOP50P310X90-8N]
IC304  TLV2197  OPA_D_TLV2197QDGKTLV2172IDGKR  [VSSOP8-DGK-065P]
IC305  TLV2197  OPA_D_TLV2197QDGKTLV2172IDGKR  [VSSOP8-DGK-065P]
J301  RA BNC 50 Ohm  BNC-4P  [BNC_AMP_227161]
J302  RA BNC 50 Ohm  BNC-4P  [BNC_AMP_227161]
J303  4P Thor LED RA  CIRCULAR-4P-THOR-F  [CIR_PHX4P_RA]
J304  4P Thor LED RA  CIRCULAR-4P-THOR-F  [CIR_PHX4P_RA]
Q301  DMG6601  MOSFET-PN  [SOT95P280X100-6N]
Q302  DMG6601  MOSFET-PN  [SOT95P280X100-6N]
Q303  BSC12DN20N  MOSFET-NBSC12DN20NS3GN-MOSFET  [TDSON-8]
Q304  BSC12DN20N  MOSFET-NBSC12DN20NS3GN-MOSFET  [TDSON-8]
R301  10 kΩ  RES_0603_10K0  [R0603]
R302  10 kΩ  RES_0603_10K0  [R0603]
R303  4.3 kΩ  RES_0603_4K30  [R0603]
R304  4.3 kΩ  RES_0603_4K30  [R0603]
R305  33 Ω  RES_0603_33R0  [R0603]
R306  33 Ω  RES_0603_33R0  [R0603]
R307  3.3 kΩ  RES_0603_3K30  [R0603]
R308  3.3 kΩ  RES_0603_3K30  [R0603]
R309  5K  RES_TRIM_5K_RA_MTURN  [MTBOURNS_RA_LONG]
R310  5K  RES_TRIM_5K_RA_MTURN  [MTBOURNS_RA_LONG]
R311  10 kΩ  RES_0603_10K0  [R0603]
R312  10 kΩ  RES_0603_10K0  [R0603]
R313  0 Ω  RES_0603_0000  [R0603]
R314  33 Ω  RES_0603_33R0  [R0603]
R315  33 Ω  RES_0603_33R0  [R0603]
R316  1 Ohm  RES_1225_  [R1225]
R317  1 Ohm  RES_1225_  [R1225]

### Nets
+3.3V: C308.2 C309.2 IC302.8(P:VCC) IC303.8(P:VCC) Q301.2(B:S) Q302.2(B:S) ; also sheet 1,2,3,5
+5V: C301.2 C302.2 C303.2 C306.2 C307.2 IC301.8(A:V+) IC304.8(A:V+) R311.2 R312.2 R313.2 ; also sheet 1,2,3,5
+VPWR: C304.2 C305.1 J303.1 J304.1 ; also sheet 1,2,3,5
C5: IC304.1(A:OUT) IC304.2(A:-IN) ; also sheet 1
C6: IC304.6(B:-IN) IC304.7(B:OUT) ; also sheet 1
GND: C301.1 C302.1 C303.1 C304.1 C305.2 C306.1 C307.1 C308.1 C309.1 IC301.4(A:V-) IC302.4(P:GND) IC303.4(P:GND) IC304.4(A:V-) IC305.4(A:V-) J301.2 J302.2 Q301.5(A:S) Q302.5(A:S) R301.1 R302.1 R309.1(START) R310.1(START) R316.1 R317.1 ; also sheet 1,2,3,5
N$148: Q301.4(B:D) R305.1
N$149: Q301.6(A:D) R303.1 R305.2 R307.1
N$150: IC302.3(B:O) Q301.1(A:G)
N$152: IC302.7(A:O) Q301.3(B:G)
N$153: IC301.3(A:+IN) J301.1 R301.2
N$155: IC301.1(A:OUT) IC301.2(A:-IN) R303.2
N$157: R307.2 R309.3(END)
N$158: IC304.3(A:+IN) IC305.3(A:+IN) R309.2(WIPER)
N$159: IC305.2(A:-IN) Q303.1(S) Q303.2(S) Q303.3(S) Q303.10(S) R311.1 R316.2
N$160: IC305.1(A:OUT) R314.1
N$161: Q303.4(G) R314.2
N$162: J303.2 Q303.5(D) Q303.6(D) Q303.7(D) Q303.8(D) Q303.9(D)
N$163: Q302.4(B:D) R306.1
N$164: Q302.6(A:D) R304.1 R306.2 R308.1
N$165: IC303.3(B:O) Q302.1(A:G)
N$166: IC303.7(A:O) Q302.3(B:G)
N$167: IC301.5(B:+IN) J302.1 R302.2
N$168: IC301.6(B:-IN) IC301.7(B:OUT) R304.2
N$169: R308.2 R310.3(END)
N$170: IC304.5(B:+IN) IC305.5(B:+IN) R310.2(WIPER)
N$171: IC305.6(B:-IN) Q304.1(S) Q304.2(S) Q304.3(S) Q304.10(S) R312.1 R317.2
N$172: Q304.4(G) R315.2
N$173: J304.2 Q304.5(D) Q304.6(D) Q304.7(D) Q304.8(D) Q304.9(D)
N$174: IC305.7(B:OUT) R315.1
N$175: IC305.8(A:V+) R313.1
RST_BUS: IC302.1(A:I0) IC302.2(A:I1) IC302.5(B:I0) IC303.1(A:I0) IC303.2(A:I1) IC303.5(B:I0) ; also sheet 1,2,3,5
TRIG_BUS: IC302.6(B:I1) IC303.6(B:I1) ; also sheet 1,2,3,5
Unconnected: J303.3 J303.4 J304.3 J304.4

### Notes on the sheet
- CH5 IN
- CH5 OUT
- CH6 IN
- CH6 OUT

## Sheet 5 of 5
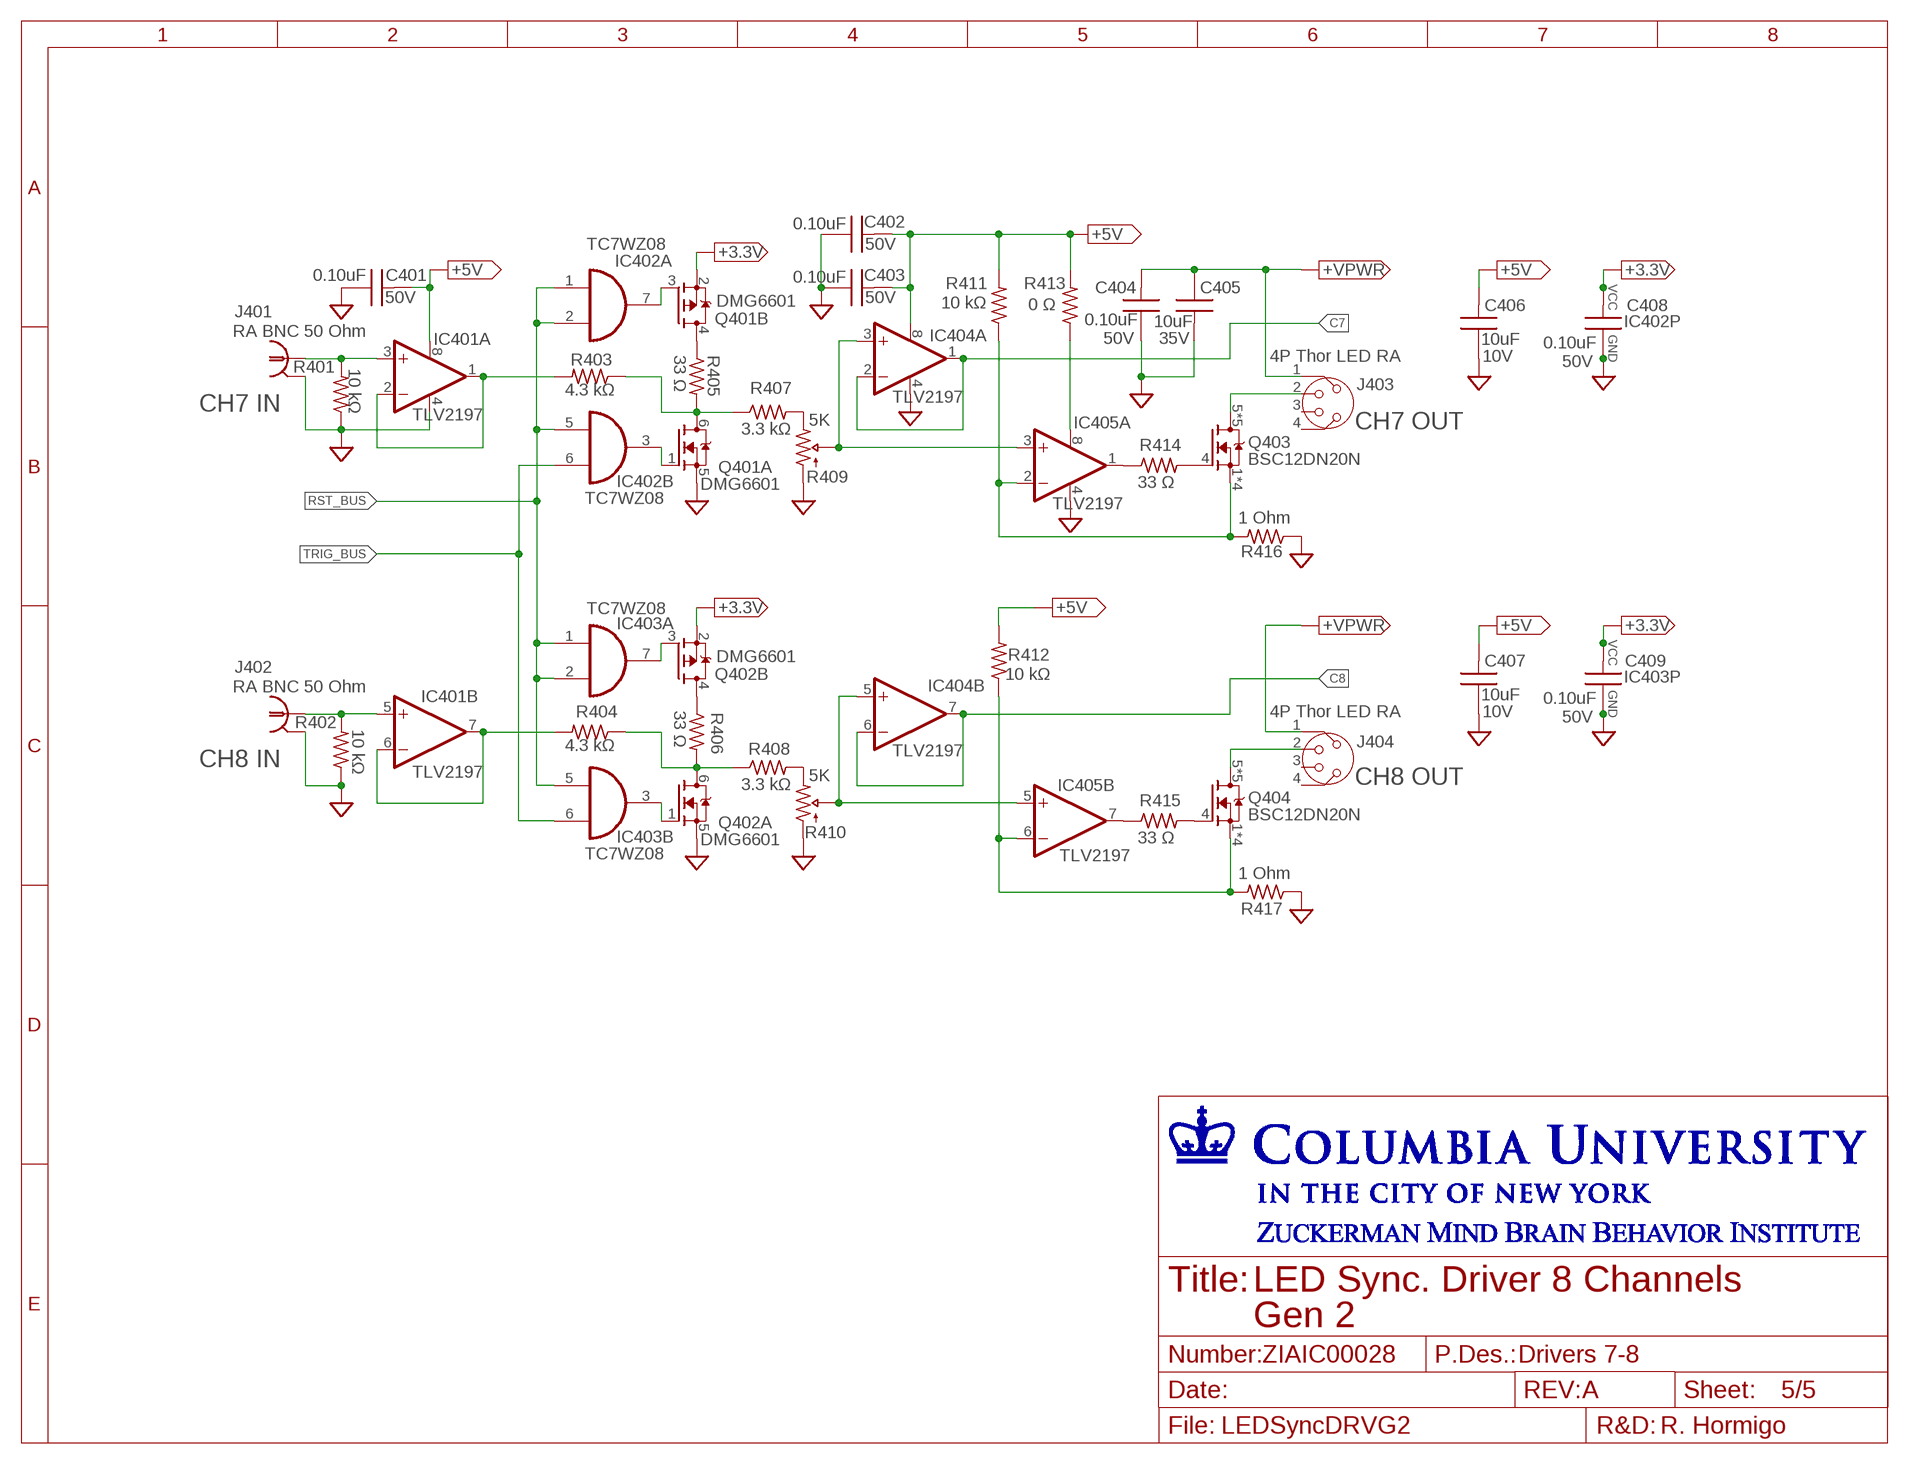
[diagram p4: schematic, sheet 5]
FRAME401 (LETTER_L): ENG_NAME: R. Hormigo; NUMBER: ZIAIC00028; PDESC: Drivers 7-8; REV: A; TITLE_L1: LED Sync. Driver 8 Channels; TITLE_L2: Gen 2

### Parts
C401  0.10uF  MLCC_0603_100N  [MLCC_0603]
C402  0.10uF  MLCC_0603_100N  [MLCC_0603]
C403  0.10uF  MLCC_0603_100N  [MLCC_0603]
C404  0.10uF  MLCC_0603_100N  [MLCC_0603]
C405  10uF  MLCC1206_  [MLCC_1206]
C406  10uF  MLCC_0603_10UF-10V  [MLCC_0603]
C407  10uF  MLCC_0603_10UF-10V  [MLCC_0603]
C408  0.10uF  MLCC_0603_100N  [MLCC_0603]
C409  0.10uF  MLCC_0603_100N  [MLCC_0603]
IC401  TLV2197  OPA_D_TLV2197QDGKTLV2172IDGKR  [VSSOP8-DGK-065P]
IC402  TC7WZ08  AND2_TSOP8  [SOP50P310X90-8N]
IC403  TC7WZ08  AND2_TSOP8  [SOP50P310X90-8N]
IC404  TLV2197  OPA_D_TLV2197QDGKTLV2172IDGKR  [VSSOP8-DGK-065P]
IC405  TLV2197  OPA_D_TLV2197QDGKTLV2172IDGKR  [VSSOP8-DGK-065P]
J401  RA BNC 50 Ohm  BNC-4P  [BNC_AMP_227161]
J402  RA BNC 50 Ohm  BNC-4P  [BNC_AMP_227161]
J403  4P Thor LED RA  CIRCULAR-4P-THOR-F  [CIR_PHX4P_RA]
J404  4P Thor LED RA  CIRCULAR-4P-THOR-F  [CIR_PHX4P_RA]
Q401  DMG6601  MOSFET-PN  [SOT95P280X100-6N]
Q402  DMG6601  MOSFET-PN  [SOT95P280X100-6N]
Q403  BSC12DN20N  MOSFET-NBSC12DN20NS3GN-MOSFET  [TDSON-8]
Q404  BSC12DN20N  MOSFET-NBSC12DN20NS3GN-MOSFET  [TDSON-8]
R401  10 kΩ  RES_0603_10K0  [R0603]
R402  10 kΩ  RES_0603_10K0  [R0603]
R403  4.3 kΩ  RES_0603_4K30  [R0603]
R404  4.3 kΩ  RES_0603_4K30  [R0603]
R405  33 Ω  RES_0603_33R0  [R0603]
R406  33 Ω  RES_0603_33R0  [R0603]
R407  3.3 kΩ  RES_0603_3K30  [R0603]
R408  3.3 kΩ  RES_0603_3K30  [R0603]
R409  5K  RES_TRIM_5K_RA_MTURN  [MTBOURNS_RA_LONG]
R410  5K  RES_TRIM_5K_RA_MTURN  [MTBOURNS_RA_LONG]
R411  10 kΩ  RES_0603_10K0  [R0603]
R412  10 kΩ  RES_0603_10K0  [R0603]
R413  0 Ω  RES_0603_0000  [R0603]
R414  33 Ω  RES_0603_33R0  [R0603]
R415  33 Ω  RES_0603_33R0  [R0603]
R416  1 Ohm  RES_1225_  [R1225]
R417  1 Ohm  RES_1225_  [R1225]

### Nets
+3.3V: C408.2 C409.2 IC402.8(P:VCC) IC403.8(P:VCC) Q401.2(B:S) Q402.2(B:S) ; also sheet 1,2,3,4
+5V: C401.2 C402.2 C403.2 C406.2 C407.2 IC401.8(A:V+) IC404.8(A:V+) R411.2 R412.2 R413.2 ; also sheet 1,2,3,4
+VPWR: C404.2 C405.1 J403.1 J404.1 ; also sheet 1,2,3,4
C7: IC404.1(A:OUT) IC404.2(A:-IN) ; also sheet 1
C8: IC404.6(B:-IN) IC404.7(B:OUT) ; also sheet 1
GND: C401.1 C402.1 C403.1 C404.1 C405.2 C406.1 C407.1 C408.1 C409.1 IC401.4(A:V-) IC402.4(P:GND) IC403.4(P:GND) IC404.4(A:V-) IC405.4(A:V-) J401.2 J402.2 Q401.5(A:S) Q402.5(A:S) R401.1 R402.1 R409.1(START) R410.1(START) R416.1 R417.1 ; also sheet 1,2,3,4
N$198: Q401.4(B:D) R405.1
N$199: Q401.6(A:D) R403.1 R405.2 R407.1
N$200: IC402.3(B:O) Q401.1(A:G)
N$202: IC402.7(A:O) Q401.3(B:G)
N$203: IC401.3(A:+IN) J401.1 R401.2
N$205: IC401.1(A:OUT) IC401.2(A:-IN) R403.2
N$207: R407.2 R409.3(END)
N$208: IC404.3(A:+IN) IC405.3(A:+IN) R409.2(WIPER)
N$209: IC405.2(A:-IN) Q403.1(S) Q403.2(S) Q403.3(S) Q403.10(S) R411.1 R416.2
N$210: IC405.1(A:OUT) R414.1
N$211: Q403.4(G) R414.2
N$212: J403.2 Q403.5(D) Q403.6(D) Q403.7(D) Q403.8(D) Q403.9(D)
N$213: Q402.4(B:D) R406.1
N$214: Q402.6(A:D) R404.1 R406.2 R408.1
N$215: IC403.3(B:O) Q402.1(A:G)
N$216: IC403.7(A:O) Q402.3(B:G)
N$217: IC401.5(B:+IN) J402.1 R402.2
N$218: IC401.6(B:-IN) IC401.7(B:OUT) R404.2
N$219: R408.2 R410.3(END)
N$220: IC404.5(B:+IN) IC405.5(B:+IN) R410.2(WIPER)
N$221: IC405.6(B:-IN) Q404.1(S) Q404.2(S) Q404.3(S) Q404.10(S) R412.1 R417.2
N$222: Q404.4(G) R415.2
N$223: J404.2 Q404.5(D) Q404.6(D) Q404.7(D) Q404.8(D) Q404.9(D)
N$224: IC405.7(B:OUT) R415.1
N$225: IC405.8(A:V+) R413.1
RST_BUS: IC402.1(A:I0) IC402.2(A:I1) IC402.5(B:I0) IC403.1(A:I0) IC403.2(A:I1) IC403.5(B:I0) ; also sheet 1,2,3,4
TRIG_BUS: IC402.6(B:I1) IC403.6(B:I1) ; also sheet 1,2,3,4
Unconnected: J403.3 J403.4 J404.3 J404.4

### Notes on the sheet
- CH7 IN
- CH7 OUT
- CH8 IN
- CH8 OUT

## Library data of the parts
C1-C3 C12-C14 C18 C20 C101-C104 C108 C109 C201-C204 C208 C209 C301-C304 C308 C309 C401-C404 C408 C409 = AIC_Caps:MLCC_0603_: MLCC 0603 C1608X5R1C155K080AB: Datasheet <https://www.mouser.com/datasheet/2/400/lcc_commercial_general_en-837201.pdf> VJ0603D1R0VXPAJ: Datasheet <https://www.mouser.com/datasheet/2/427/vjhifreq-1391225.pdf>; DATASHEET: https://www.mouser.com/datasheet/2/40/X7RDielectric-777024.pdf; DESCRIPTION: Multilayer Ceramic Capacitor (MLCC)X7R 0603, 0.10uF 5%, 50V; MNF: AVX; MPN: 06035C104JAT2A; TOLERANCE: 5%; VENDOR: Mouser; VOLTAGE: 50V
C4 C105 C205 C305 C405 = AIC_Caps:MLCC1206_: Ceramic Capacitor 1206 Source: Datasheet <https://componentsearchengine.com/Datasheets/1/TMK316AB7106KLHT.pdf>; DATASHEET: https://componentsearchengine.com/Datasheets/1/TMK316AB7106KLHT.pdf; DESCRIPTION: Ceramic Capacitor X7R 1206 35V 10uF; HEIGHT: 1.25mm; MNF: TAIYO YUDEN; MPN: GMK316AB7106KL-TR; VENDOR: Mouser; VOLTAGE: 35V
C5 C6 C17 = AIC_Caps:MLCC_0603_: MLCC 0603 C1608X5R1C155K080AB: Datasheet <https://www.mouser.com/datasheet/2/400/lcc_commercial_general_en-837201.pdf> VJ0603D1R0VXPAJ: Datasheet <https://www.mouser.com/datasheet/2/427/vjhifreq-1391225.pdf>; DATASHEET: https://www.mouser.com/datasheet/2/400/lcc_automotive_general_en-843974.pdf; DESCRIPTION: Multilayer Ceramic Capacitor (MLCC)X7R 0603, 1uF 10%, 35V; MNF: TDK; MPN: CGA3E1X7R1V105K080AC; TOLERANCE: 10%; VENDOR: Mouser; VOLTAGE: 35V
C7 = AIC_Caps:MLCC_0603_: MLCC 0603 C1608X5R1C155K080AB: Datasheet <https://www.mouser.com/datasheet/2/400/lcc_commercial_general_en-837201.pdf> VJ0603D1R0VXPAJ: Datasheet <https://www.mouser.com/datasheet/2/427/vjhifreq-1391225.pdf>; DATASHEET: https://psearch.en.murata.com/capacitor/lineup/gcm/?excid=ww_pa-o_ow_ctl_c02e-21_2017#a01; DESCRIPTION: Multilayer Ceramic Capacitor (MLCC)C0G HF 0603, 47pF 1%, 100V; MNF: Murata; MPN: GCM1885C2A470FA16D; TOLERANCE: 1%; VENDOR: Mouser; VOLTAGE: 100V
C8-C11 C19 C106 C107 C206 C207 C306 C307 C406 C407 = AIC_Caps:MLCC_0603_: MLCC 0603 C1608X5R1C155K080AB: Datasheet <https://www.mouser.com/datasheet/2/400/lcc_commercial_general_en-837201.pdf> VJ0603D1R0VXPAJ: Datasheet <https://www.mouser.com/datasheet/2/427/vjhifreq-1391225.pdf>; DATASHEET: https://www.mouser.com/datasheet/2/40/cx5r-776519.pdf; DESCRIPTION: Multilayer Ceramic Capacitor (MLCC)X5R 0603, 10uF 10%, 10V; MNF: AVX; MPN: 0603ZD106KAT2A; TOLERANCE: 10%; VENDOR: Mouser; VOLTAGE: 10V
C15 C16 = AIC_Caps:MLCC_0603_: MLCC 0603 C1608X5R1C155K080AB: Datasheet <https://www.mouser.com/datasheet/2/400/lcc_commercial_general_en-837201.pdf> VJ0603D1R0VXPAJ: Datasheet <https://www.mouser.com/datasheet/2/427/vjhifreq-1391225.pdf>; DATASHEET: https://www.mouser.com/datasheet/2/427/vjhifreq-1391225.pdf; DESCRIPTION: Multilayer Ceramic Capacitor (MLCC)C0G HF 0603, 10pF 5%, 250V; MNF: Murata; MPN: VJ0603D100JXPAJ; TOLERANCE: 5%; VENDOR: Mouser; VOLTAGE: 250V
D1 = AIC_Semi:DIODE_ZENER: ZENNER 0.5W Datasheet <https://www.mouser.com/datasheet/2/308/MMSZ2V4T1-D-87271.pdf>; CURRENT: 100mA; DATASHEET: https://www.mouser.com/datasheet/2/308/MMSZ2V4T1-D-87271.pdf; DESCRIPTION: ZENNER DIODE, 0.5W, 3.6V, SMT SOD123-2; MNF: ON Semi; MPN: MMSZ3V6T1G; POWER: 0.5W max; VENDOR: Mouser
D2 = AIC_Semi:DIODE_REC: Rectifier Diode NHP220SF: Datasheet <https://www.mouser.com/datasheet/2/308/NHP220SF-D-599951.pdf>; CURRENT: 1A; DATASHEET: https://www.onsemi.com/pub/Collateral/NHP140SF-D.PDF.pdf; DESCRIPTION: Rectifier Diode 1A 400V. SOD−123FL; MNF: ON Semi; MPN: NHP140SFT3G; POWER: 330 degC/W; VENDOR: Mouser
DS1 = AIC_Modules:DISPLAY20P: OLED Displays & Accessories OLED 256 x 64 Yellow 89.2 x 44.0 x 6.0 Source: Datasheet <https://componentsearchengine.com/Datasheets/1/NHD-3.12-25664UCY2.pdf>; DATASHEET: https://www.mouser.com/datasheet/2/291/NHD_3_12_25664UCY2-1902151.pdf; DESCRIPTION: OLED Display 256 x 64 Yellow 89.2 x 44.0 x 6.0 3.0V; MNF: Newhaven Display; MPN: NHD-3.12-25664UCY2; VENDOR: Mouser
H1-H6 = AIC_Doc:M-HOLE: MOUNTING HOLE with drill center marker
IC1 = AIC_ICs:AP63200: Switching Voltage Regulators DCDC Conv HV Buck TSOT26 Source: Datasheet <https://componentsearchengine.com/Datasheets/1/AP63200WU-7.pdf>; DESCRIPTION: Switching Voltage Regulators DCDC Conv HV Buck TSOT26; HEIGHT: 1mm; MNF: Diodes Inc.; MPN: AP63200WU-7
IC2 = AIC_ICs:LDO8P_: LDO REGULATORS in 8 PIN; DATASHEET: https://www.ti.com/lit/ds/symlink/tlv767.pdf?ts=1612309893782&ref_url=https%253A%252F%252Fwww.mouser.com%252F; DESCRIPTION: Precision Linear Voltage Regulator FIX 3.3V 1A 16V max in Drop 1.5V VSSOP PAD; MNF: TI; MPN: TLV76733DGNR; VENDOR: Mouser
IC3 IC5 IC102 IC103 IC202 IC203 IC302 IC303 IC402 IC403 = AIC_ICs:AND2_TSOP8: Logic Gates AND Dual LMOS Source: Datasheet <https://componentsearchengine.com/Datasheets/1/TC7WZ08FKTE85LF.pdf>; DATASHEET: https://toshiba.semicon-storage.com/info/docget.jsp?did=54672&prodName=TC7WZ08FK; DESCRIPTION: Logic Gates Dual AND in TSSOP; MNF: Toshiba; MPN: TC7WZ08FK; VENDOR: Mouser
IC4 = AIC_ICs:STM32F410C: ARM MCU STM32F410 Cortex M4 125DMips Source: Datasheet <https://www.st.com/resource/en/datasheet/stm32f410cb.pdf>; DATASHEET: https://www.mouser.com/datasheet/2/389/stm32f410cb-1851313.pdf; DESCRIPTION: MCU STM32F410 Cortex M4 125DMips 128KBFlash, 32KB Ram, ADC/DAC, LQFP48; MNF: STMicroelectronics; MPN: STM32F410CBT3; VENDOR: Mouser
IC101 IC104 IC105 IC201 IC204 IC205 IC301 IC304 IC305 IC401 IC404 IC405 = AIC_ICs:OPA_D_: Dual Operational Amplifiers; DATASHEET: https://www.ti.com/lit/ds/symlink/tlv197-q1.pdf?ts=1595483432163&ref_url=https%253A%252F%252Fwww.ti.com%252Fstore%252Fti%252Fen%252Fp%252Fproduct%252F%253Fp%253DTLV197QDGKRQ1; DESCRIPTION: 36-V, Single-Supply, 10-MHz, Rail-to-Rail IN&Output, Dual Operational Amplifier; MNF: Texas Instruments; MPN: TLV2197QDGKRQ1; VENDOR: Mouser
J1 = AIC_Connectors:PIN-1X3: 1X3 Headers; CURRENT: 3A; DATASHEET: https://www.mouser.com/datasheet/2/276/705550071_sd-1608181.pdf; DESCRIPTION: Header RA Male 1X3 Gold Shrouded 0.1"; DIMENSIONS: 0.1" Pitch; MNF: Molex; MPN: 70555-0072; VENDOR: Mouser
J2 = AIC_Connectors:PIN-2X5: 2X5 RA Headers; CURRENT: 1A; DATASHEET: https://www.mouser.com/datasheet/2/1/TS0818-221281.pdf; DESCRIPTION: Header RA Male 2X5 Gold Shrouded 0.1"; DIMENSIONS: 0.1" Pitch; MNF: 3M; MPN: 30310-5002HB; VENDOR: Mouser
J3 J101 J102 J201 J202 J301 J302 J401 J402 = AIC_Connectors:BNC-4P: JACK, RIGHT ANGLE, 50 OHM Isolated 5227161-6: Datasheet <https://www.te.com/commerce/DocumentDelivery/DDEController?Action=srchrtrv&DocNm=5227161&DocType=Customer+Drawing&DocLang=English&PartCntxt=5227161-6&DocFormat=pdf>; DATASHEET: https://www.te.com/commerce/DocumentDelivery/DDEController?Action=srchrtrv&DocNm=5227161&DocType=Customer+Drawing&DocLang=English&PartCntxt=5227161-6&DocFormat=pdf; DESCRIPTION: BNC R.A. JACK 50 OHM ISOLATED; MNF: TE; MPN: 5227161-6; VENDOR: Mouser
J4 J5 J9 = AIC_Connectors:PIN-1X2: 1X2 Header; CURRENT: 3A; DATASHEET: https://www.mouser.com/datasheet/2/18/77311-1266344.pdf; DESCRIPTION: Header Straight Male 1 X 2 (2.54mm square) 6.75mm post; DIMENSIONS: 2.54mm Pitch X 6.75mm post; MNF: Amphenol FCI; MPN: 77311-124-02LF; VENDOR: Mouser
J6 = AIC_Connectors:PIN-1X6: 6X1 Headers; CURRENT: 3A; DATASHEET: https://www.mouser.com/datasheet/2/18/77311-1266344.pdf; DESCRIPTION: Header Straight Male 1 X 6 (2.54mm square) 6.75mm post; DIMENSIONS: 2.54mm Pitch X 6.75mm post; MNF: Amphenol FCI; MPN: 77311-124-06LF; VENDOR: Mouser
J7 J8 = AIC_Connectors:PIN-1X6: 6X1 Headers; CURRENT: 3A; DATASHEET: https://www.mouser.com/datasheet/2/18/77311-1266344.pdf; DESCRIPTION: Header Straight Male 1 X 6 (2.54mm square) 6.75mm post; DIMENSIONS: 2.54mm Pitch X 6.75mm post; MNF: NP; MPN: NP; VENDOR: Mouser
J103 J104 J203 J204 J303 J304 J403 J404 = AIC_Connectors:CIRCULAR-4P-THOR-F: JACK, Circular 4 Pin Female RA Thor LEDs 5227161-6: Datasheet <https://www.mouser.com/datasheet/2/324/4/1526169-1415351.pdf>; DATASHEET: https://www.mouser.com/datasheet/2/324/4/1526169-1415351.pdf; DESCRIPTION: Circular 4 PIN Female RA Thor Led Pinout; MNF: Phoenix; MPN: 1526169; VENDOR: Mouser
L1 = AIC_Inductors:INDUCTOR: TDK VLS-EX Series Type 5045 Shielded Wire-wound SMD Inductor with a Ferrite Core, 10 uH Wire-Wound 2.5A Idc Source: Datasheet <https://componentsearchengine.com/Datasheets/1/VLS5045EX-100M.pdf>; DATASHEET: https://componentsearchengine.com/Datasheets/1/VLS5045EX-100M.pdf; DESCRIPTION: TDK VLS-EX Series Type 5045 Shielded Wire-wound SMD Inductor with a Ferrite Core, 10 uH Wire-Wound 2.5A Idc; HEIGHT: 4.5mm; MNF: TDK; MPN: VLS5045EX-100M; VENDOR: Mouser
M1 = AIC_Modules:PS_MOLEX8P: Power Supplies AC-DC Module; DATASHEET: https://www.cincon.com/productdownload/SPEC-CFM100M-V19.pdf; DESCRIPTION: OPEN FRAME 3X5" AC-DC PS MODULE WITH PFC ,100W MEDICAL&ITE, 7.5V 13.4A; MNF: Cincon; MPN: CFM100M075; VENDOR: Mouser
Q101 Q102 Q201 Q202 Q301 Q302 Q401 Q402 = AIC_Semi:MOSFET-PN: Diodes Inc DMG6601LVT-7 Dual N/P-channel MOSFET, 2A, 3A, 30 V, 6-Pin TSOT-26 Source: Datasheet <https://www.diodes.com/assets/Datasheets/DMG6601LVT.pdf>; DATASHEET: https://www.diodes.com/assets/Datasheets/DMG6601LVT.pdf; DESCRIPTION: Diodes Inc DMG6601LVT-7 Dual N/P-channel MOSFET, 2 A, 3A, 30 V, 6-Pin TSOT-26; MNF: Diodes; MPN: DMG6601LVT-7; VENDOR: Mouser
Q103 Q104 Q203 Q204 Q303 Q304 Q403 Q404 = AIC_Semi:MOSFET-N: N-CH MOSFET BSC010N04LS6ATMA1: Datasheet <https://www.infineon.com/dgdl/Infineon-BSC010N04LS6-DS-v02_00-EN.pdf?fileId=5546d462689a790c0168bd076e184818> BSS138: Datasheet <https://componentsearchengine.com/Datasheets/1/BSS138.pdf>; CURRENT: 11.3A; DATASHEET: https://www.mouser.com/datasheet/2/196/BSC12DN20NS3%20Rev2.2-58027.pdf; DESCRIPTION: N CH MOSFET 200V, 11.3A, 125mOhm ON, 12S gfs, SMT TDSON-8; MNF: Infineon; MPN: BSC12DN20NS3 G; POWER: 50W; VENDOR: Mouser
R1 = AIC_Resistors:RES_0603_: 0603 Resistor; DATASHEET: http://www.vishay.com/docs/20035/dcrcwe3.pdf; DESCRIPTION: Thick Film Resistor 0603, 56 kΩ ,1%, 0.1W; MNF: Vishay; MPN: CRCW060356K0FKEA; POWER: 0.1W; TOLERANCE: 1%; VENDOR: Mouser
R2 R4 R6 R10-R12 R101 R102 R111 R112 R201 R202 R211 R212 R301 R302 R311 R312 R401 R402 R411 R412 = AIC_Resistors:RES_0603_: 0603 Resistor; DATASHEET: http://www.vishay.com/docs/20035/dcrcwe3.pdf; DESCRIPTION: Thick Film Resistor 0603, 10 kΩ ,1%, 0.1W; MNF: Vishay; MPN: CRCW060310K0FKEA; POWER: 0.1W; TOLERANCE: 1%; VENDOR: Mouser
R3 R5 R7 R8 = AIC_Resistors:RES_0603_: 0603 Resistor; DATASHEET: http://www.vishay.com/docs/20035/dcrcwe3.pdf; DESCRIPTION: Thick Film Resistor 0603, 100 Ω ,1%, 0.1W; MNF: Vishay; MPN: CRCW0603100RFKEA; POWER: 0.1W; TOLERANCE: 1%; VENDOR: Mouser
R9 R13 R113 R213 R313 R413 = AIC_Resistors:RES_0603_: 0603 Resistor; DATASHEET: http://www.vishay.com/docs/20035/dcrcwe3.pdf; DESCRIPTION: Thick Film Resistor 0603, 0 Ω ,1%, 0.1W; MNF: Vishay; MPN: CRCW06030000Z0EA; VENDOR: Mouser
R14 = AIC_Resistors:RES_0603_: 0603 Resistor; DESCRIPTION: No Placed/Populated Resistor
R103 R104 R203 R204 R303 R304 R403 R404 = AIC_Resistors:RES_0603_: 0603 Resistor; DATASHEET: http://www.vishay.com/docs/20035/dcrcwe3.pdf; DESCRIPTION: Thick Film Resistor 0603, 4.3 kΩ ,1%, 0.1W; MNF: Vishay; MPN: CRCW06034K30FKEA; POWER: 0.1W; TOLERANCE: 1%; VENDOR: Mouser
R105 R106 R114 R115 R205 R206 R214 R215 R305 R306 R314 R315 R405 R406 R414 R415 = AIC_Resistors:RES_0603_: 0603 Resistor; DATASHEET: http://www.vishay.com/docs/20035/dcrcwe3.pdf; DESCRIPTION: Thick Film Resistor 0603, 33 Ω ,1%, 0.1W; MNF: Vishay; MPN: CRCW060333R0FKEA; POWER: 0.1W; TOLERANCE: 1%; VENDOR: Mouser
R107 R108 R207 R208 R307 R308 R407 R408 = AIC_Resistors:RES_0603_: 0603 Resistor; DATASHEET: http://www.vishay.com/docs/20035/dcrcwe3.pdf; DESCRIPTION: Thick Film Resistor 0603, 3.3 kΩ ,1%, 0.1W; MNF: Vishay; MPN: CRCW06033K30FKEA; POWER: 0.1W; TOLERANCE: 1%; VENDOR: Mouser
R109 R110 R209 R210 R309 R310 R409 R410 = AIC_Resistors:RES_TRIM_: Trimmers; DATASHEET: https://www.mouser.com/datasheet/2/54/3006-1649234.pdf; DESCRIPTION: Multi Turn Resistor Long, Through Hole RA 5K 10% 3/4"; MNF: Bourns; MPN: 3006P-7-502LF; VENDOR: Mouser
R116 R117 R216 R217 R316 R317 R416 R417 = AIC_Resistors:RES_1225_: Thick Film Resistors - SMD 1 ohm 1% 3W AEC-Q200 Source: Datasheet <https://www.mouser.com/datasheet/2/219/WK73S-1840148.pdf>; DATASHEET: https://www.mouser.com/datasheet/2/219/WK73S-1840148.pdf; DESCRIPTION: Thick Film Resistor Reversed 1225 1 ohm 1% 3W; MNF: KOA Speer; MPN: WK73S3A3TTE1R00F; VENDOR: Mouser
S1 S2 = AIC_ElectroMec:MOM_SWITCH_SPST_SH: Pushbutton Switches SPST OFF(ON) PC MNT Source: Datasheet <http://spec_sheets.e-switch.com/specs/T811006.pdf>; DATASHEET: https://www.mouser.com/datasheet/2/140/800-345975.pdf; DESCRIPTION: Pushbutton Switch SPST RA PCB With Mounting NON-THD; MNF: E-Switch; MPN: 800SP9B6M6RE; VENDOR: Mouser
S3 = AIC_ElectroMec:SWITCH_X8_DIP: SPST DIP Switch Datasheet <https://www.mouser.com/datasheet/2/670/ds03_254-1777715.pdf>; CURRENT: 25ma; DATASHEET: https://www.mouser.com/datasheet/2/670/ds03_254-1777715.pdf; DESCRIPTION: DIP Switches SPST, 2.54 pitch, Raised actuator, RA, 8 position, Blue; MNF: CUI; MPN: DS03-254-08BE; VENDOR: Mouser; VOLTAGE: 24V
U$1-U$3 = AIC_Doc:FIDUCIAL: For use by pick and place machines to calibrate the vision/machine, 1mm By microbuilder.eu
Y1 = AIC_ElectroMec:XTAL4P: Crystals 3.2X2.5mm Source: Datasheet <https://www.mouser.com/datasheet/2/122/ecx-32-1100709.pdf>; DATASHEET: https://www.mouser.com/datasheet/2/122/ecx-32-1100709.pdf; DESCRIPTION: Crystal 3.2X2.5mm 24MHz 15ppm 8pF -30C +55C; MNF: ECS; MPN: ECS-240-8-33-RWY-TR; VENDOR: Mouser